# EAGLE design joule_shield (EAGLE 6.5.0)

## Sheet 1 of 12
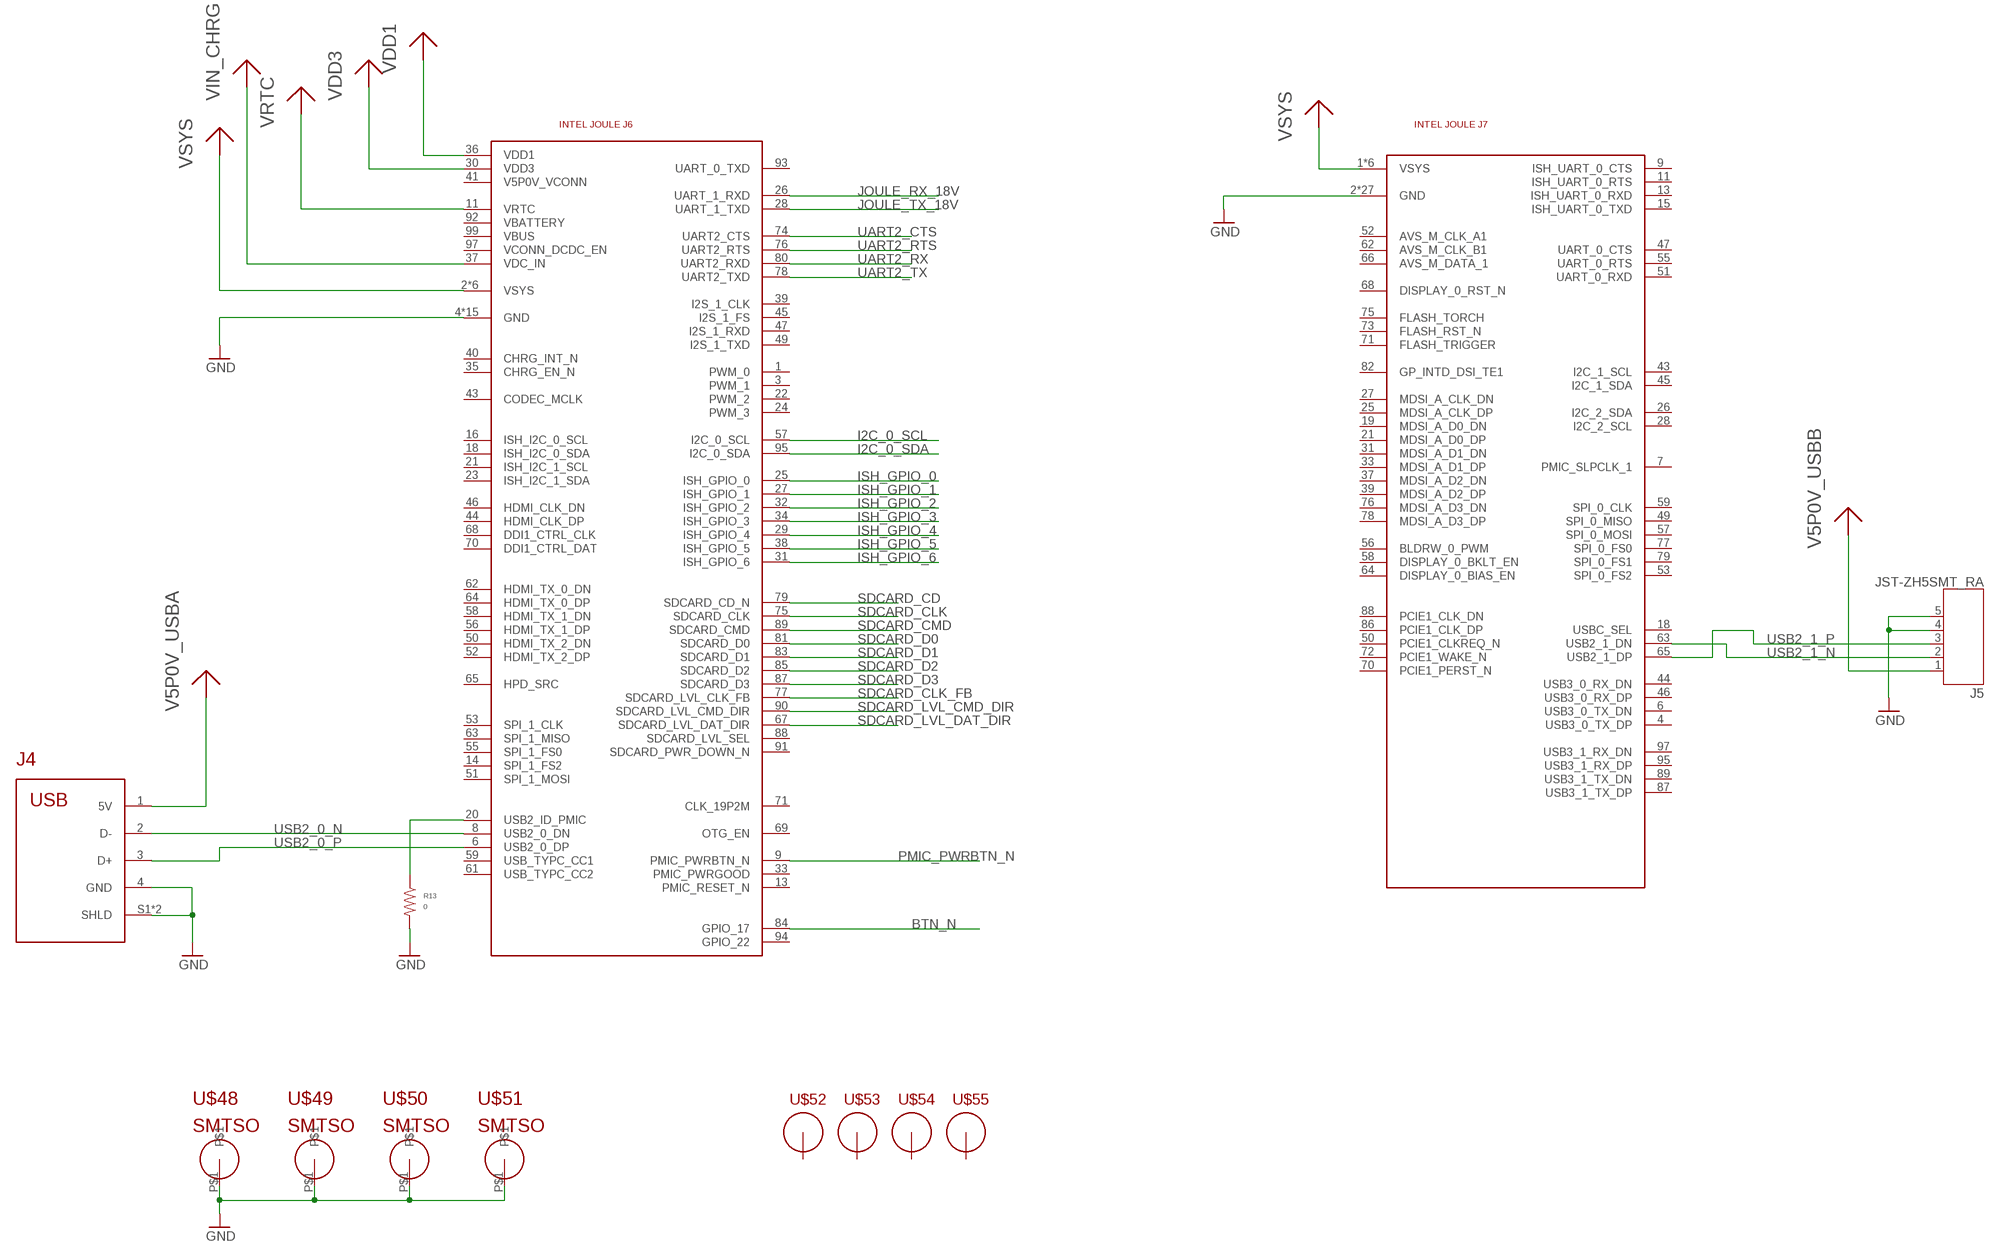
[diagram p0: schematic, sheet 1]

### Parts
J4  USB_AUSB_A_SMT_RA  [USB_RECPT_87583]
J5  JST-ZH5SMT_RA  [JST_ZH_SMT_RA_5]
J6  INTEL_JOULE_J6  [HIROSE-40C-100DS]
J7  INTEL_JOULE_J7  [HIROSE-40C-100DS]
R13  0  RESISTOR_0603  [R0603]
U$48  SMTSOSMTSO-M1.6  [SMTSO-M1.6]
U$49  SMTSOSMTSO-M1.6  [SMTSO-M1.6]
U$50  SMTSOSMTSO-M1.6  [SMTSO-M1.6]
U$51  SMTSOSMTSO-M1.6  [SMTSO-M1.6]
U$52  M2.5MOUNT  [M2.5MOUNT]
U$53  M2.5MOUNT  [M2.5MOUNT]
U$54  M2.5MOUNT  [M2.5MOUNT]
U$55  M2.5MOUNT  [M2.5MOUNT]

### Nets
BTN_N: J6.84(GPIO_17) ; also sheet 9
GND: J4.4(GND) J4.S1(SHLD) J4.S2(SHLD) J5.4 J5.5 J6.4(GND) J6.10(GND) J6.19(GND) J6.42(GND) J6.48(GND) J6.54(GND) J6.60(GND) J6.66(GND) J6.72(GND) J6.73(GND) J6.82(GND) J6.86(GND) J6.96(GND) J6.98(GND) J6.100(GND) J7.2(GND) J7.5(GND) J7.8(GND) J7.10(GND) J7.16(GND) J7.17(GND) J7.23(GND) J7.24(GND) J7.29(GND) J7.30(GND) J7.35(GND) J7.36(GND) J7.41(GND) J7.42(GND) J7.54(GND) J7.60(GND) J7.61(GND) J7.67(GND) J7.74(GND) J7.80(GND) J7.84(GND) J7.85(GND) J7.90(GND) J7.91(GND) J7.93(GND) J7.96(GND) J7.99(GND) R13.P$2 U$48.P$1 U$49.P$1 U$50.P$1 U$51.P$1 ; also sheet 2,3,4,5,6,7,8,9,10,11,12
I2C_0_SCL: J6.57(I2C_0_SCL) ; also sheet 2
I2C_0_SDA: J6.95(I2C_0_SDA) ; also sheet 2
ISH_GPIO_0: J6.25(ISH_GPIO_0) ; also sheet 12
ISH_GPIO_1: J6.27(ISH_GPIO_1) ; also sheet 12
ISH_GPIO_2: J6.32(ISH_GPIO_2) ; also sheet 12
ISH_GPIO_3: J6.34(ISH_GPIO_3) ; also sheet 6
ISH_GPIO_4: J6.29(ISH_GPIO_4) ; also sheet 6
ISH_GPIO_5: J6.38(ISH_GPIO_5) ; also sheet 6
ISH_GPIO_6: J6.31(ISH_GPIO_6) ; also sheet 6
JOULE_RX_18V: J6.26(UART_1_RXD) ; also sheet 7
JOULE_TX_18V: J6.28(UART_1_TXD) ; also sheet 7
N$10: J6.20(USB2_ID_PMIC) R13.P$1
PMIC_PWRBTN_N: J6.9(PMIC_PWRBTN_N) ; also sheet 2,9
SDCARD_CD: J6.79(SDCARD_CD_N) ; also sheet 10
SDCARD_CLK: J6.75(SDCARD_CLK) ; also sheet 10
SDCARD_CLK_FB: J6.77(SDCARD_LVL_CLK_FB) ; also sheet 10
SDCARD_CMD: J6.89(SDCARD_CMD) ; also sheet 10
SDCARD_D0: J6.81(SDCARD_D0) ; also sheet 10
SDCARD_D1: J6.83(SDCARD_D1) ; also sheet 10
SDCARD_D2: J6.85(SDCARD_D2) ; also sheet 10
SDCARD_D3: J6.87(SDCARD_D3) ; also sheet 10
SDCARD_LVL_CMD_DIR: J6.90(SDCARD_LVL_CMD_DIR) ; also sheet 10
SDCARD_LVL_DAT_DIR: J6.67(SDCARD_LVL_DAT_DIR) ; also sheet 10
UART2_CTS: J6.74(UART2_CTS) ; also sheet 11
UART2_RTS: J6.76(UART2_RTS) ; also sheet 11
UART2_RX: J6.80(UART2_RXD) ; also sheet 11
UART2_TX: J6.78(UART2_TXD) ; also sheet 9,11
USB2_0_N [USB]: J4.2(D-) J6.8(USB2_0_DN)
USB2_0_P [USB]: J4.3(D+) J6.6(USB2_0_DP)
USB2_1_N [USB]: J5.2 J7.63(USB2_1_DN)
USB2_1_P [USB]: J5.3 J7.65(USB2_1_DP)
V5P0V_USBA: J4.1(5V) ; also sheet 6
V5P0V_USBB: J5.1 ; also sheet 6
VDD1: J6.36(VDD1) ; also sheet 5,6,9
VDD3: J6.30(VDD3) ; also sheet 3,4
VIN_CHRG: J6.37(VDC_IN) ; also sheet 2,8
VRTC: J6.11(VRTC) ; also sheet 9
VSYS: J6.2(VSYS) J6.5(VSYS) J6.7(VSYS) J6.12(VSYS) J6.15(VSYS) J6.17(VSYS) J7.1(VSYS) J7.3(VSYS) J7.20(VSYS) J7.22(VSYS) J7.32(VSYS) J7.34(VSYS) ; also sheet 2,3,12
Unconnected: J6.1(PWM_0) J6.3(PWM_1) J6.13(PMIC_RESET_N) J6.14(SPI_1_FS2) J6.16(ISH_I2C_0_SCL) J6.18(ISH_I2C_0_SDA) J6.21(ISH_I2C_1_SCL) J6.22(PWM_2) J6.23(ISH_I2C_1_SDA) J6.24(PWM_3) J6.33(PMIC_PWRGOOD) J6.35(CHRG_EN_N) J6.39(I2S_1_CLK) J6.40(CHRG_INT_N) J6.41(V5P0V_VCONN) J6.43(CODEC_MCLK) J6.44(HDMI_CLK_DP) J6.45(I2S_1_FS) J6.46(HDMI_CLK_DN) J6.47(I2S_1_RXD) J6.49(I2S_1_TXD) J6.50(HDMI_TX_2_DN) J6.51(SPI_1_MOSI) J6.52(HDMI_TX_2_DP) J6.53(SPI_1_CLK) J6.55(SPI_1_FS0) J6.56(HDMI_TX_1_DP) J6.58(HDMI_TX_1_DN) J6.59(USB_TYPC_CC1) J6.61(USB_TYPC_CC2) J6.62(HDMI_TX_0_DN) J6.63(SPI_1_MISO) J6.64(HDMI_TX_0_DP) J6.65(HPD_SRC) J6.68(DDI1_CTRL_CLK) J6.69(OTG_EN) J6.70(DDI1_CTRL_DAT) J6.71(CLK_19P2M) J6.88(SDCARD_LVL_SEL) J6.91(SDCARD_PWR_DOWN_N) J6.92(VBATTERY) J6.93(UART_0_TXD) J6.94(GPIO_22) J6.97(VCONN_DCDC_EN) J6.99(VBUS) J7.4(USB3_0_TX_DP) J7.6(USB3_0_TX_DN) J7.7(PMIC_SLPCLK_1) J7.9(ISH_UART_0_CTS) J7.11(ISH_UART_0_RTS) J7.13(ISH_UART_0_RXD) J7.15(ISH_UART_0_TXD) J7.18(USBC_SEL) J7.19(MDSI_A_D0_DN) J7.21(MDSI_A_D0_DP) J7.25(MDSI_A_CLK_DP) J7.26(I2C_2_SDA) J7.27(MDSI_A_CLK_DN) J7.28(I2C_2_SCL) J7.31(MDSI_A_D1_DN) J7.33(MDSI_A_D1_DP) J7.37(MDSI_A_D2_DN) J7.39(MDSI_A_D2_DP) J7.43(I2C_1_SCL) J7.44(USB3_0_RX_DN) J7.45(I2C_1_SDA) J7.46(USB3_0_RX_DP) J7.47(UART_0_CTS) J7.49(SPI_0_MISO) J7.50(PCIE1_CLKREQ_N) J7.51(UART_0_RXD) J7.52(AVS_M_CLK_A1) J7.53(SPI_0_FS2) J7.55(UART_0_RTS) J7.56(BLDRW_0_PWM) J7.57(SPI_0_MOSI) J7.58(DISPLAY_0_BKLT_EN) J7.59(SPI_0_CLK) J7.62(AVS_M_CLK_B1) J7.64(DISPLAY_0_BIAS_EN) J7.66(AVS_M_DATA_1) J7.68(DISPLAY_0_RST_N) J7.70(PCIE1_PERST_N) J7.71(FLASH_TRIGGER) J7.72(PCIE1_WAKE_N) J7.73(FLASH_RST_N) J7.75(FLASH_TORCH) J7.76(MDSI_A_D3_DN) J7.77(SPI_0_FS0) J7.78(MDSI_A_D3_DP) J7.79(SPI_0_FS1) J7.82(GP_INTD_DSI_TE1) J7.86(PCIE1_CLK_DP) J7.87(USB3_1_TX_DP) J7.88(PCIE1_CLK_DN) J7.89(USB3_1_TX_DN) J7.95(USB3_1_RX_DP) J7.97(USB3_1_RX_DN) U$52.P$1 U$53.P$1 U$54.P$1 U$55.P$1

## Sheet 2 of 12
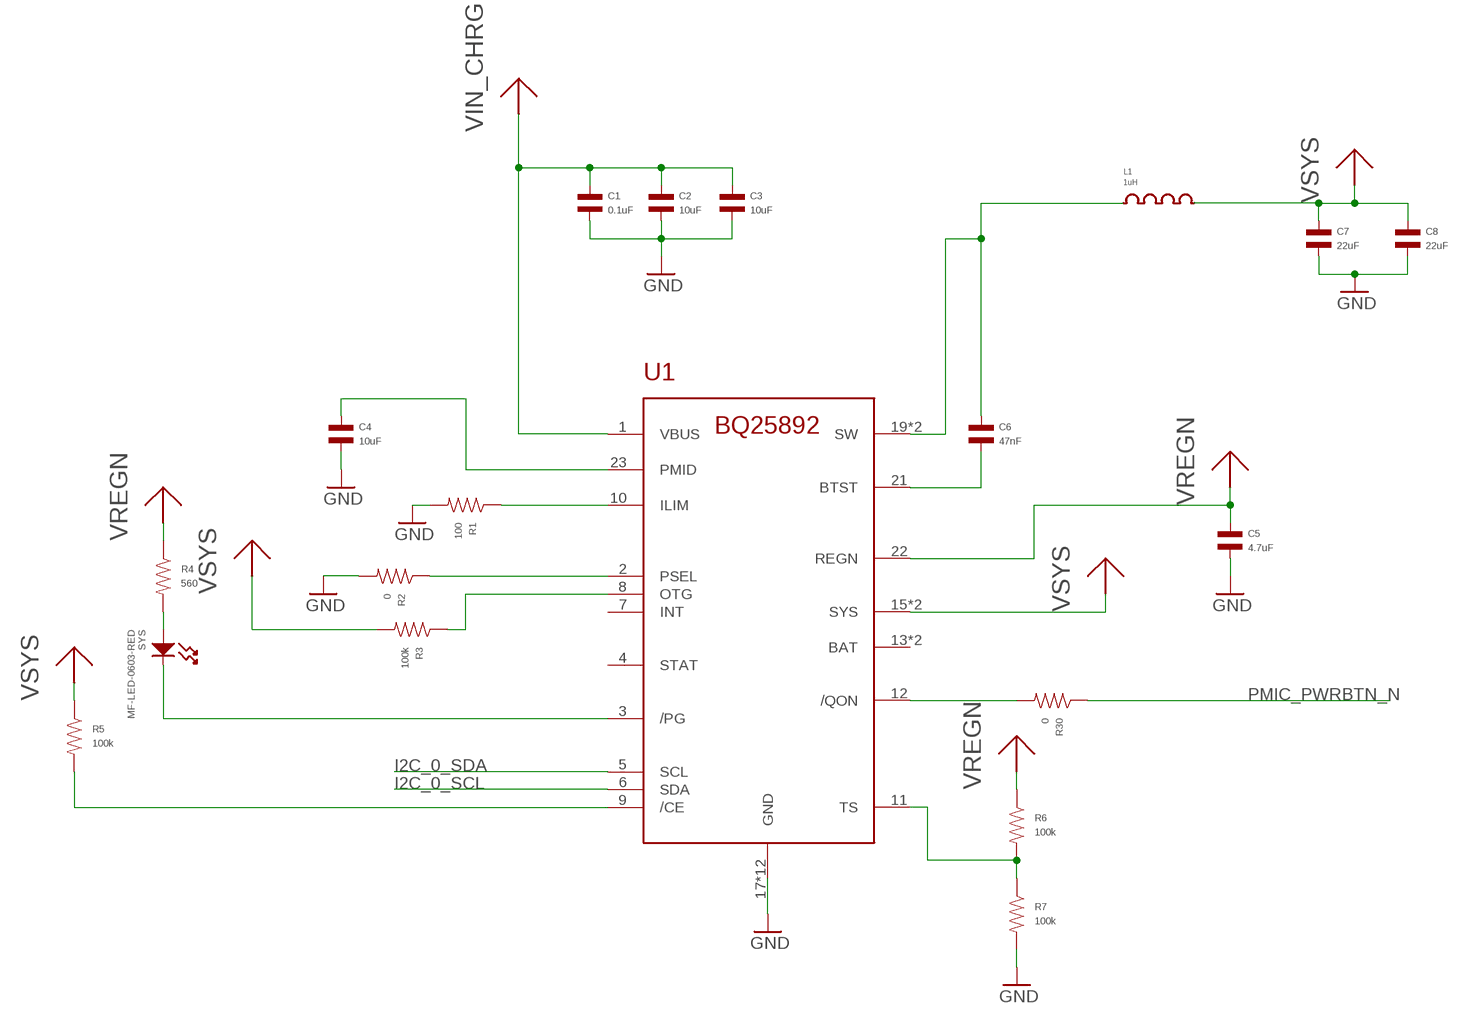
[diagram p1: schematic, sheet 2]

### Parts
C1  0.1uF  CAPACITOR_NP_0603  [C0603]
C2  10uF  CAPACITOR_NP_0603  [C0603]
C3  10uF  CAPACITOR_NP_0603  [C0603]
C4  10uF  CAPACITOR_NP_0603  [C0603]
C5  4.7uF  CAPACITOR_NP_0603  [C0603]
C6  47nF  CAPACITOR_NP_0603  [C0603]
C7  22uF  CAPACITOR_NP_0603  [C0603]
C8  22uF  CAPACITOR_NP_0603  [C0603]
L1  1uH  INDUCTORSPM4012  [SPM4012]
R1  100  RESISTOR_0603  [R0603]
R2  0  RESISTOR_0603  [R0603]
R3  100k  RESISTOR_0603  [R0603]
R4  560  RESISTOR_0603  [R0603]
R5  100k  RESISTOR_0603  [R0603]
R6  100k  RESISTOR_0603  [R0603]
R7  100k  RESISTOR_0603  [R0603]
R30  0  RESISTOR_0603  [R0603]
SYS  MF-LED-0603-RED  LED_SINGLE-0603-RED  [LED0603]
U1  BQ25892PWQFN-24  [PWQFN-24]

### Nets
GND: C1.P$2 C2.P$2 C3.P$2 C4.P$2 C5.P$2 C7.P$2 C8.P$2 R1.P$2 R2.P$2 R7.P$2 U1.17(GND) U1.18(GND) U1.G0(GND) U1.G1(GND) U1.G2(GND) U1.G3(GND) U1.G4(GND) U1.G5(GND) U1.G6(GND) U1.G7(GND) U1.G8(GND) U1.G9(GND) ; also sheet 1,3,4,5,6,7,8,9,10,11,12
I2C_0_SCL: U1.6(SDA) ; also sheet 1
I2C_0_SDA: U1.5(SCL) ; also sheet 1
N$1: R4.P$2 SYS.ANODE
N$2: C4.P$1 U1.23(PMID)
N$3: R1.P$1 U1.10(ILIM)
N$4: R2.P$1 U1.2(PSEL)
N$5: R3.P$1 U1.8(OTG)
N$6: SYS.CATHODE U1.3(/PG)
N$8: R6.P$2 R7.P$1 U1.11(TS)
N$9: R5.P$2 U1.9(/CE)
N$11: C6.P$2 U1.21(BTST)
N$12: C6.P$1 L1.1 U1.19(SW) U1.20(SW)
N$51: R30.P$2 U1.12(/QON)
PMIC_PWRBTN_N: R30.P$1 ; also sheet 1,9
VIN_CHRG: C1.P$1 C2.P$1 C3.P$1 U1.1(VBUS) ; also sheet 1,8
VREGN: C5.P$1 R4.P$1 R6.P$1 U1.22(REGN)
VSYS: C7.P$1 C8.P$1 L1.2 R3.P$2 R5.P$1 U1.15(SYS) U1.16(SYS) ; also sheet 1,3,12
Unconnected: U1.4(STAT) U1.7(INT) U1.13(BAT) U1.14(BAT)

## Sheet 3 of 12
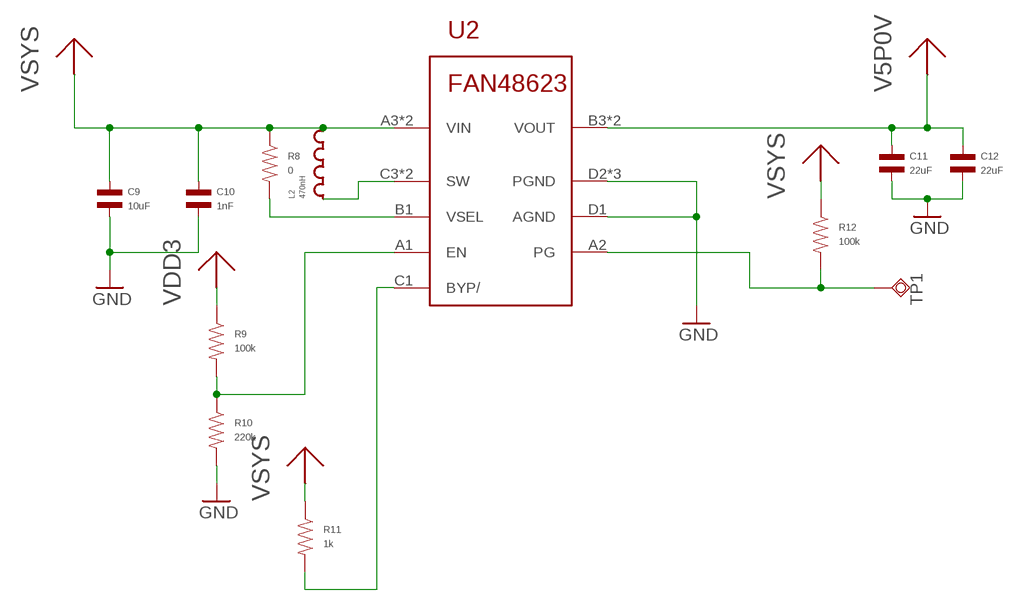
[diagram p2: schematic, sheet 3]

### Parts
C9  10uF  CAPACITOR_NP_0603  [C0603]
C10  1nF  CAPACITOR_NP_0603  [C0603]
C11  22uF  CAPACITOR_NP_0603  [C0603]
C12  22uF  CAPACITOR_NP_0603  [C0603]
L2  470nH  INDUCTORDFE252010P  [DFE252010P]
R8  0  RESISTOR_0603  [R0603]
R9  100k  RESISTOR_0603  [R0603]
R10  220k  RESISTOR_0603  [R0603]
R11  1k  RESISTOR_0603  [R0603]
R12  100k  RESISTOR_0603  [R0603]
TP1  TPSQB1,27  [B1,27]
U2  FAN8623WLCSP16  [WLCSP16]

### Nets
GND: C9.P$2 C10.P$2 C11.P$2 C12.P$2 R10.P$2 U2.D1(AGND) U2.D2(PGND) U2.D3(PGND) U2.D4(PGND) ; also sheet 1,2,4,5,6,7,8,9,10,11,12
N$7: R8.P$2 U2.B1(VSEL)
N$13: L2.1 U2.C3(SW) U2.C4(SW)
N$14: R9.P$2 R10.P$1 U2.A1(EN)
N$15: R11.P$2 U2.C1(BYP/)
N$18: R12.P$2 TP1.TP U2.A2(PG)
V5P0V: C11.P$1 C12.P$1 U2.B3(VOUT) U2.B4(VOUT) ; also sheet 6,7,9,11
VDD3: R9.P$1 ; also sheet 1,4
VSYS: C9.P$1 C10.P$1 L2.2 R8.P$1 R11.P$1 R12.P$1 U2.A3(VIN) U2.A4(VIN) ; also sheet 1,2,12

## Sheet 4 of 12
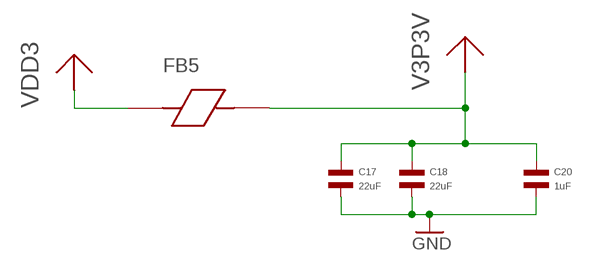
[diagram p3: schematic, sheet 4]

### Parts
C17  22uF  CAPACITOR_NP_0603  [C0603]
C18  22uF  CAPACITOR_NP_0603  [C0603]
C20  1uF  CAPACITOR_NP_0603  [C0603]
FB5  FERRITE_BEAD  [R0603]

### Nets
GND: C17.P$2 C18.P$2 C20.P$2 ; also sheet 1,2,3,5,6,7,8,9,10,11,12
V3P3V: C17.P$1 C18.P$1 C20.P$1 FB5.P$2 ; also sheet 9,10
VDD3: FB5.P$1 ; also sheet 1,3

## Sheet 5 of 12
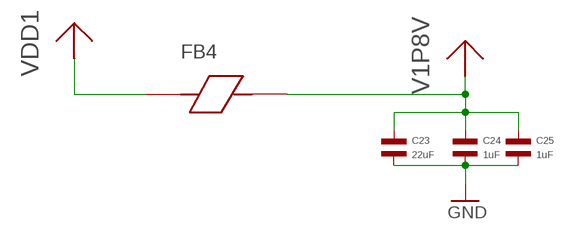
[diagram p4: schematic, sheet 5]

### Parts
C23  22uF  CAPACITOR_NP_0603  [C0603]
C24  1uF  CAPACITOR_NP_0603  [C0603]
C25  1uF  CAPACITOR_NP_0603  [C0603]
FB4  FERRITE_BEAD  [R0603]

### Nets
GND: C23.P$2 C24.P$2 C25.P$2 ; also sheet 1,2,3,4,6,7,8,9,10,11,12
V1P8V: C23.P$1 C24.P$1 C25.P$1 FB4.P$2 ; also sheet 7,10,11
VDD1: FB4.P$1 ; also sheet 1,6,9

## Sheet 6 of 12
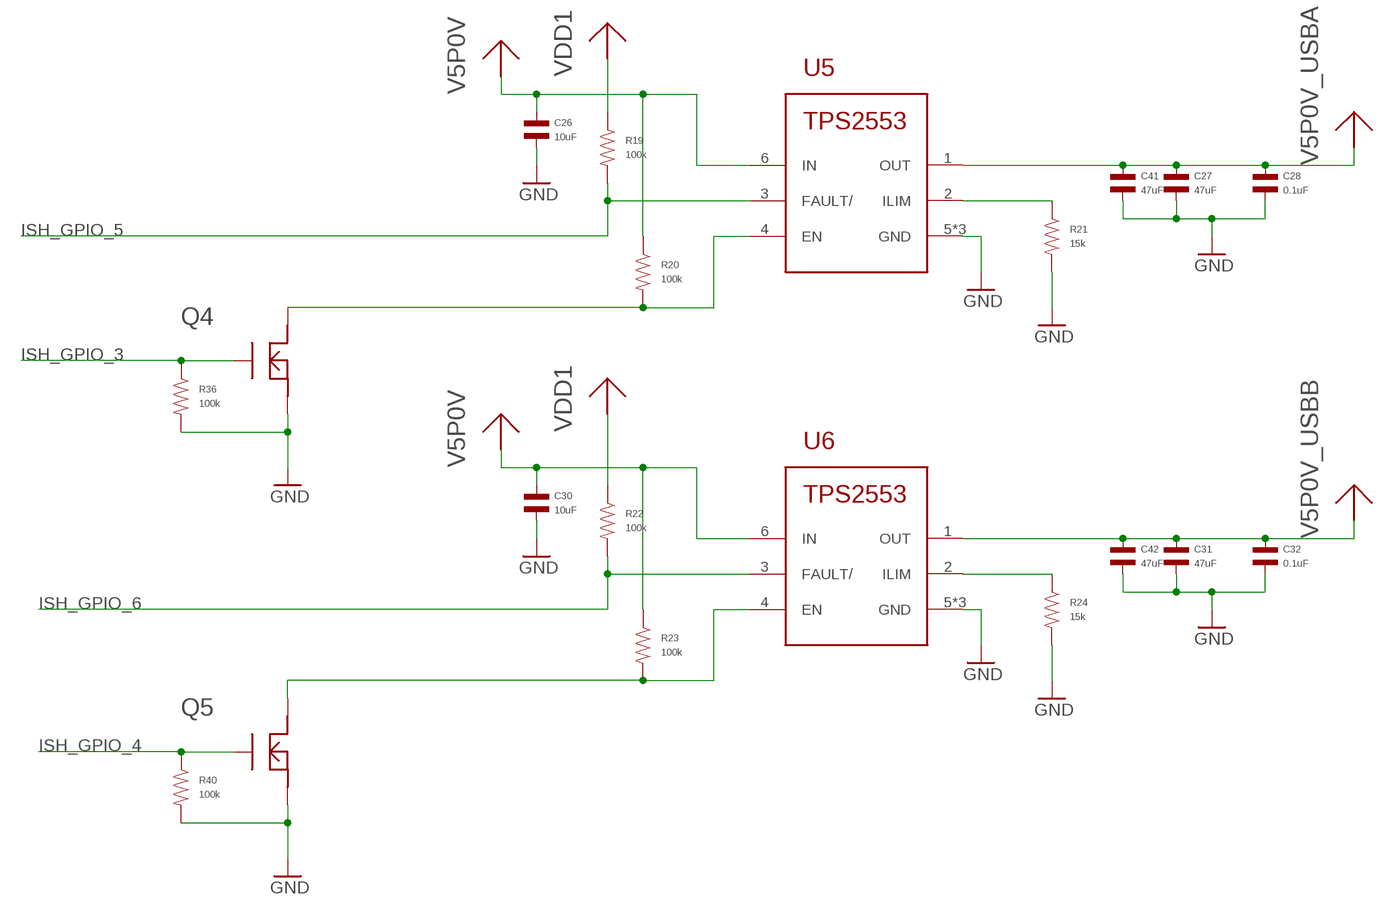
[diagram p5: schematic, sheet 6]

### Parts
C26  10uF  CAPACITOR_NP_0603  [C0603]
C27  47uF  CAPACITOR_NP_0805  [C0805]
C28  0.1uF  CAPACITOR_NP_0603  [C0603]
C30  10uF  CAPACITOR_NP_0603  [C0603]
C31  47uF  CAPACITOR_NP_0805  [C0805]
C32  0.1uF  CAPACITOR_NP_0603  [C0603]
C41  47uF  CAPACITOR_NP_0805  [C0805]
C42  47uF  CAPACITOR_NP_0805  [C0805]
Q4  NFETEMT3F  [EMT3F]
Q5  NFETEMT3F  [EMT3F]
R19  100k  RESISTOR_0603  [R0603]
R20  100k  RESISTOR_0603  [R0603]
R21  15k  RESISTOR_0603  [R0603]
R22  100k  RESISTOR_0603  [R0603]
R23  100k  RESISTOR_0603  [R0603]
R24  15k  RESISTOR_0603  [R0603]
R36  100k  RESISTOR_0603  [R0603]
R40  100k  RESISTOR_0603  [R0603]
U5  TPS2553PWSON-6  [PWSON-6]
U6  TPS2553PWSON-6  [PWSON-6]

### Nets
GND: C26.P$2 C27.P$2 C28.P$2 C30.P$2 C31.P$2 C32.P$2 C41.P$2 C42.P$2 Q4.2(S) Q5.2(S) R21.P$2 R24.P$2 R36.P$2 R40.P$2 U5.5(GND) U5.G0(GND) U5.G1(GND) U6.5(GND) U6.G0(GND) U6.G1(GND) ; also sheet 1,2,3,4,5,7,8,9,10,11,12
ISH_GPIO_3: Q4.1(G) R36.P$1 ; also sheet 1
ISH_GPIO_4: Q5.1(G) R40.P$1 ; also sheet 1
ISH_GPIO_5: R19.P$2 U5.3(FAULT/) ; also sheet 1
ISH_GPIO_6: R22.P$2 U6.3(FAULT/) ; also sheet 1
N$24: Q4.3(D) R20.P$2 U5.4(EN)
N$29: R21.P$1 U5.2(ILIM)
N$33: Q5.3(D) R23.P$2 U6.4(EN)
N$34: R24.P$1 U6.2(ILIM)
V5P0V: C26.P$1 C30.P$1 R20.P$1 R23.P$1 U5.6(IN) U6.6(IN) ; also sheet 3,7,9,11
V5P0V_USBA: C27.P$1 C28.P$1 C41.P$1 U5.1(OUT) ; also sheet 1
V5P0V_USBB: C31.P$1 C32.P$1 C42.P$1 U6.1(OUT) ; also sheet 1
VDD1: R19.P$1 R22.P$1 ; also sheet 1,5,9

## Sheet 7 of 12
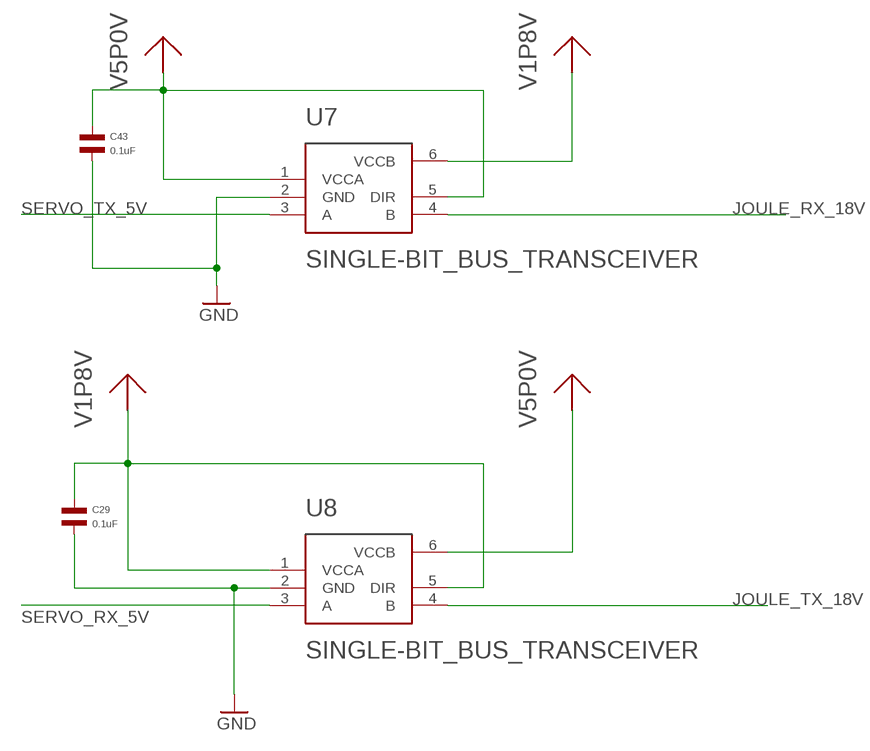
[diagram p6: schematic, sheet 7]

### Parts
C29  0.1uF  CAPACITOR_NP_0603  [C0603]
C43  0.1uF  CAPACITOR_NP_0603  [C0603]
U7  SINGLE-BIT_BUS_TRANSCEIVER  [SOT23-6]
U8  SINGLE-BIT_BUS_TRANSCEIVER  [SOT23-6]

### Nets
GND: C29.P$2 C43.P$2 U7.2(GND) U8.2(GND) ; also sheet 1,2,3,4,5,6,8,9,10,11,12
JOULE_RX_18V: U7.4(B) ; also sheet 1
JOULE_TX_18V: U8.4(B) ; also sheet 1
SERVO_RX_5V: U8.3(A) ; also sheet 8
SERVO_TX_5V: U7.3(A) ; also sheet 8
V1P8V: C29.P$1 U7.6(VCCB) U8.1(VCCA) U8.5(DIR) ; also sheet 5,10,11
V5P0V: C43.P$1 U7.1(VCCA) U7.5(DIR) U8.6(VCCB) ; also sheet 3,6,9,11

## Sheet 8 of 12
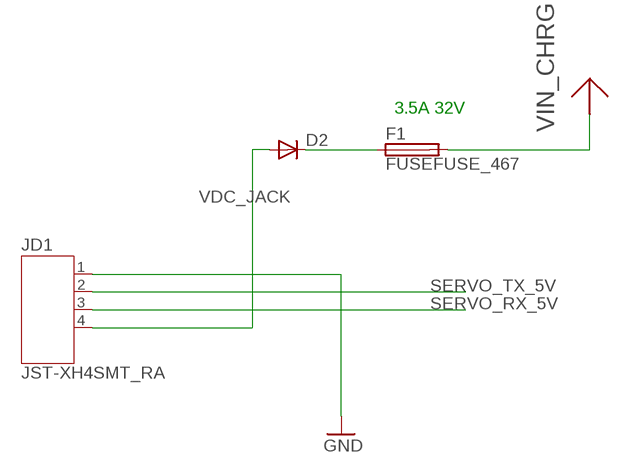
[diagram p7: schematic, sheet 8]

### Parts
D2  DIODE-B520C  [B520C]
F1  FUSEFUSE_467  [FUSE_467]
JD1  JST-XH4SMT_RA  [JST_XH_SMT_RA_4]

### Nets
GND: JD1.1 ; also sheet 1,2,3,4,5,6,7,9,10,11,12
N$31: D2.1(C) F1.1
SERVO_RX_5V: JD1.3 ; also sheet 7
SERVO_TX_5V: JD1.2 ; also sheet 7
VDC_JACK: D2.2(A) JD1.4
VIN_CHRG: F1.2 ; also sheet 1,2

### Notes on the sheet
- 3.5A 32V

## Sheet 9 of 12
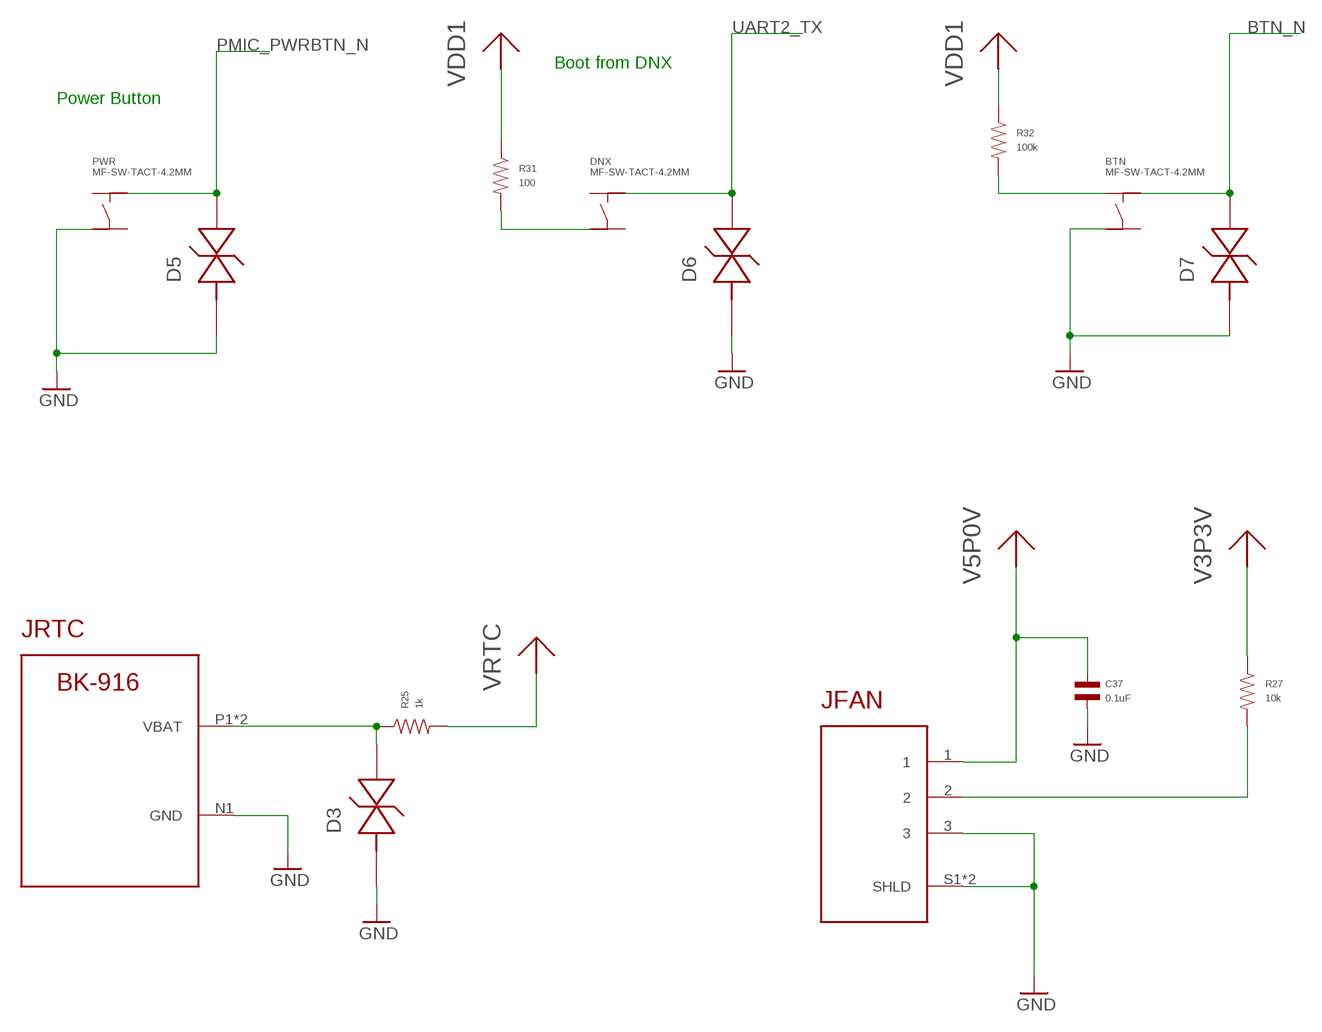
[diagram p8: schematic, sheet 9]

### Parts
BTN  MF-SW-TACT-4.2MM  TACT_4.2MM  [TACT4.2MM]
C37  0.1uF  CAPACITOR_NP_0603  [C0603]
D3  ESD_DIODEM1005  [M1005]
D5  ESD_DIODEM1005  [M1005]
D6  ESD_DIODEM1005  [M1005]
D7  ESD_DIODEM1005  [M1005]
DNX  MF-SW-TACT-4.2MM  TACT_4.2MM  [TACT4.2MM]
JFAN  AMP_MINI_FAN  [AMP_MINI_292228]
JRTC  BC-2009  [BC-2009]
PWR  MF-SW-TACT-4.2MM  TACT_4.2MM  [TACT4.2MM]
R25  1k  RESISTOR_0603  [R0603]
R27  10k  RESISTOR_0603  [R0603]
R31  100  RESISTOR_0603  [R0603]
R32  100k  RESISTOR_0603  [R0603]

### Nets
BTN_N: BTN.P$2 D7.P$2 ; also sheet 1
GND: BTN.P$3 C37.P$2 D3.P$1 D5.P$1 D6.P$1 D7.P$1 JFAN.3 JFAN.S1(SHLD) JFAN.S2(SHLD) JRTC.N1(GND) PWR.P$3 ; also sheet 1,2,3,4,5,6,7,8,10,11,12
N$30: D3.P$2 JRTC.P1(VBAT) JRTC.P2(VBAT) R25.P$1
N$36: JFAN.2 R27.P$2
N$52: DNX.P$3 R31.P$2
N$54: BTN.P$1 R32.P$2
PMIC_PWRBTN_N: D5.P$2 PWR.P$2 ; also sheet 1,2
UART2_TX: D6.P$2 DNX.P$2 ; also sheet 1,11
V3P3V: R27.P$1 ; also sheet 4,10
V5P0V: C37.P$1 JFAN.1 ; also sheet 3,6,7,11
VDD1: R31.P$1 R32.P$1 ; also sheet 1,5,6
VRTC: R25.P$2 ; also sheet 1
Unconnected: BTN.P$4 DNX.P$1 DNX.P$4 PWR.P$1 PWR.P$4

### Notes on the sheet
- Boot from DNX
- Power Button

## Sheet 10 of 12
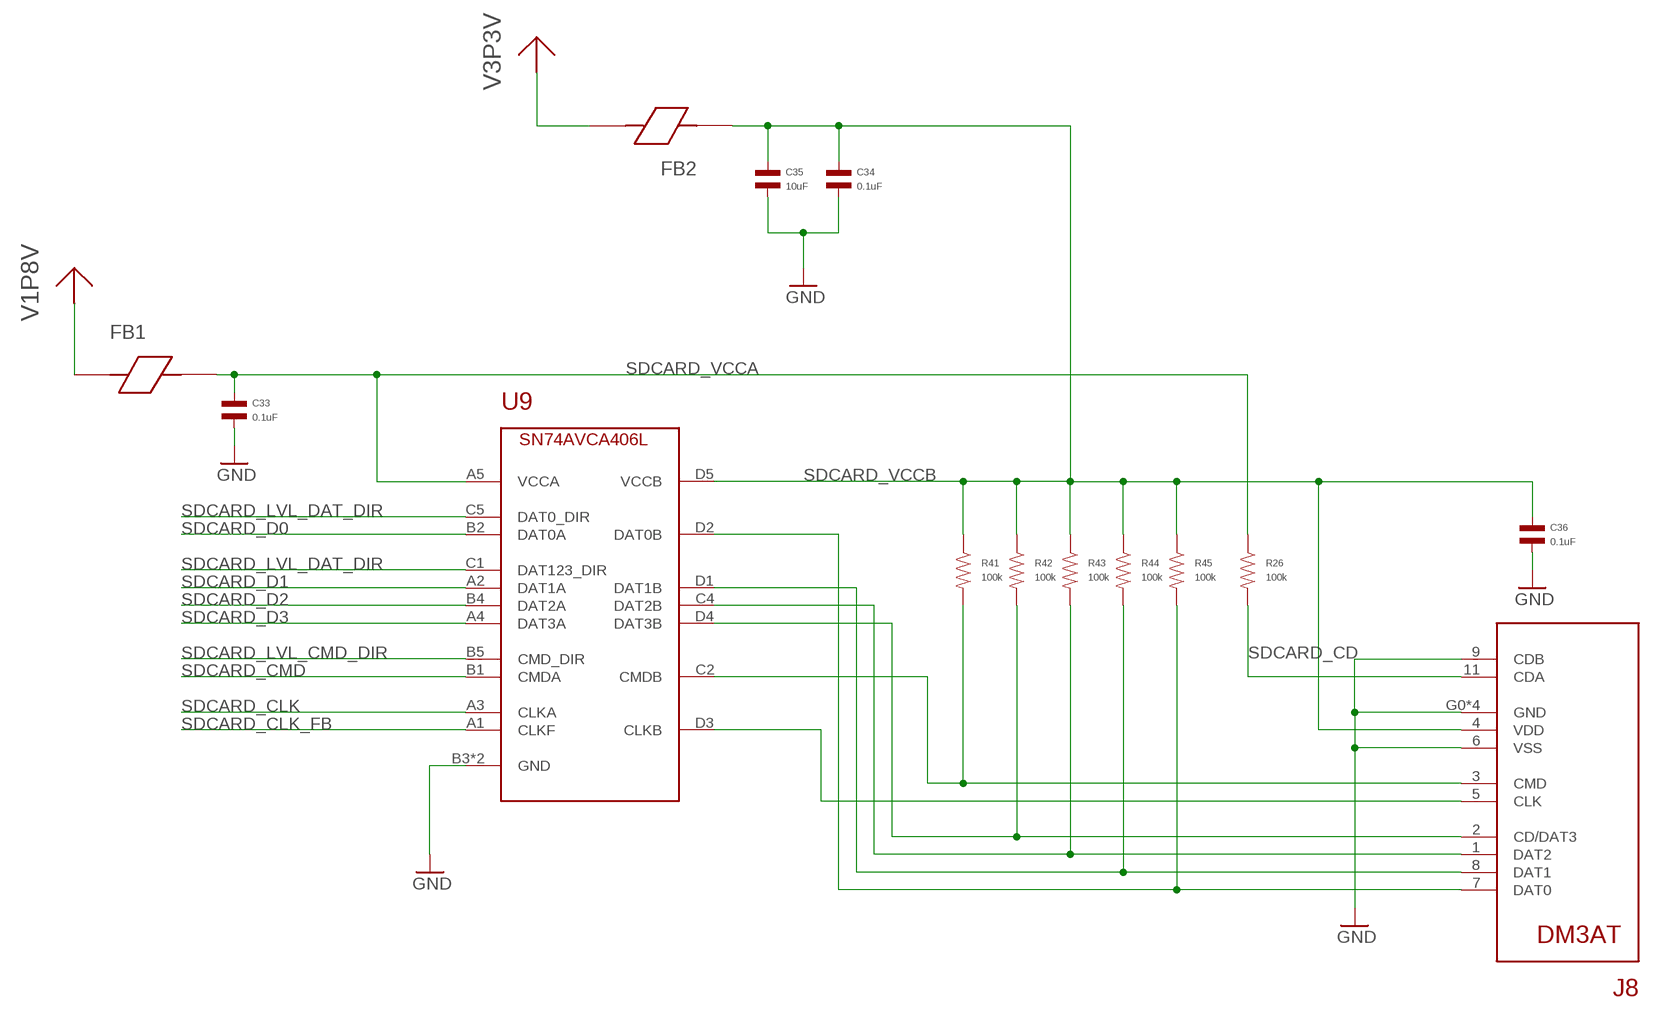
[diagram p9: schematic, sheet 10]

### Parts
C33  0.1uF  CAPACITOR_NP_0603  [C0603]
C34  0.1uF  CAPACITOR_NP_0603  [C0603]
C35  10uF  CAPACITOR_NP_0603  [C0603]
C36  0.1uF  CAPACITOR_NP_0603  [C0603]
FB1  FERRITE_BEAD  [R0603]
FB2  FERRITE_BEAD  [R0603]
J8  DM3ATDM3AT  [DM3AT]
R26  100k  RESISTOR_0603  [R0603]
R41  100k  RESISTOR_0603  [R0603]
R42  100k  RESISTOR_0603  [R0603]
R43  100k  RESISTOR_0603  [R0603]
R44  100k  RESISTOR_0603  [R0603]
R45  100k  RESISTOR_0603  [R0603]
U9  SN74AVCA406L  [S-PBGA-N20]

### Nets
GND: C33.P$2 C34.P$2 C35.P$2 C36.P$2 J8.6(VSS) J8.9(CDB) J8.G0(GND) J8.G1(GND) J8.G2(GND) J8.G3(GND) U9.B3(GND) U9.C3(GND) ; also sheet 1,2,3,4,5,6,7,8,9,11,12
N$41: J8.8(DAT1) R44.P$2 U9.D1(DAT1B)
N$42: J8.1(DAT2) R43.P$2 U9.C4(DAT2B)
N$43: J8.2(CD/DAT3) R42.P$2 U9.D4(DAT3B)
N$44: J8.3(CMD) R41.P$2 U9.C2(CMDB)
N$45: J8.5(CLK) U9.D3(CLKB)
N$69: J8.7(DAT0) R45.P$2 U9.D2(DAT0B)
SDCARD_CD: J8.11(CDA) R26.P$2 ; also sheet 1
SDCARD_CLK: U9.A3(CLKA) ; also sheet 1
SDCARD_CLK_FB: U9.A1(CLKF) ; also sheet 1
SDCARD_CMD: U9.B1(CMDA) ; also sheet 1
SDCARD_D0: U9.B2(DAT0A) ; also sheet 1
SDCARD_D1: U9.A2(DAT1A) ; also sheet 1
SDCARD_D2: U9.B4(DAT2A) ; also sheet 1
SDCARD_D3: U9.A4(DAT3A) ; also sheet 1
SDCARD_LVL_CMD_DIR: U9.B5(CMD_DIR) ; also sheet 1
SDCARD_LVL_DAT_DIR: U9.C1(DAT123_DIR) U9.C5(DAT0_DIR) ; also sheet 1
SDCARD_VCCA: C33.P$1 FB1.P$2 R26.P$1 U9.A5(VCCA)
SDCARD_VCCB: C34.P$1 C35.P$1 C36.P$1 FB2.P$1 J8.4(VDD) R41.P$1 R42.P$1 R43.P$1 R44.P$1 R45.P$1 U9.D5(VCCB)
V1P8V: FB1.P$1 ; also sheet 5,7,11
V3P3V: FB2.P$2 ; also sheet 4,9

## Sheet 11 of 12
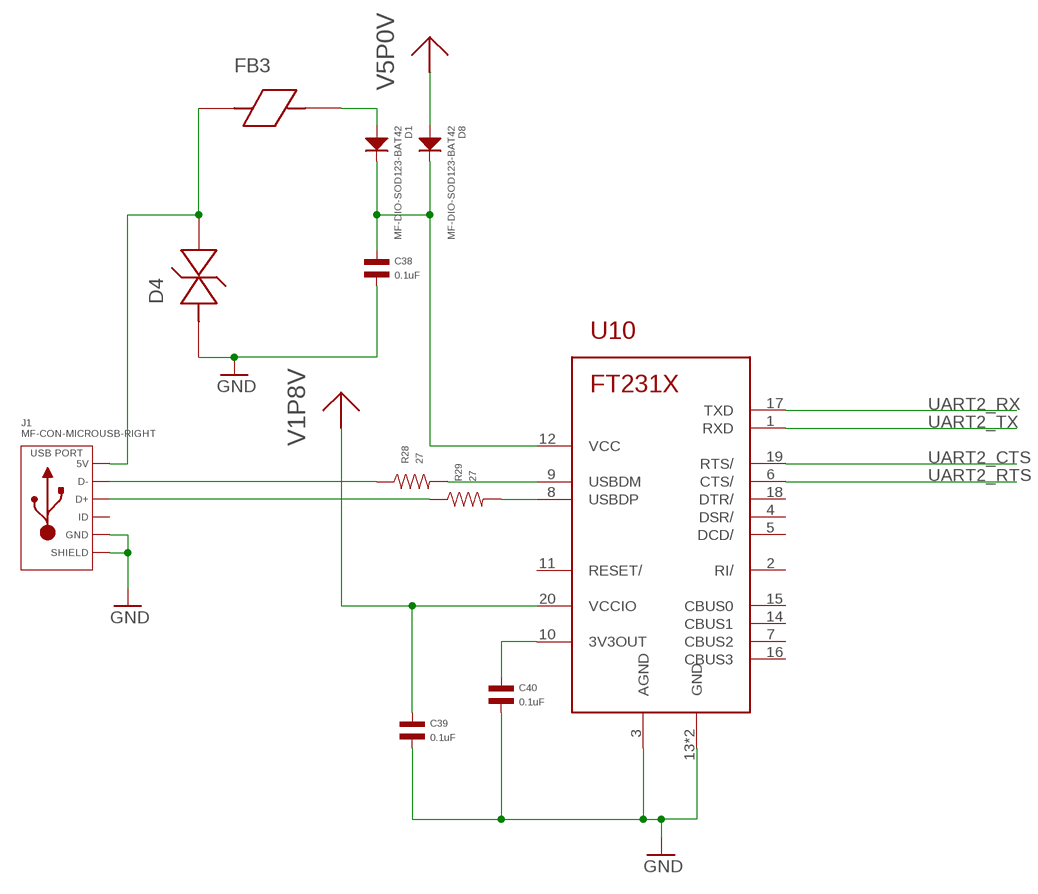
[diagram p10: schematic, sheet 11]

### Parts
C38  0.1uF  CAPACITOR_NP_0603  [C0603]
C39  0.1uF  CAPACITOR_NP_0603  [C0603]
C40  0.1uF  CAPACITOR_NP_0603  [C0603]
D1  MF-DIO-SOD123-BAT42  DIODES_BAT42_SOD-123  [SOD-123]
D4  ESD_DIODEM1005  [M1005]
D8  MF-DIO-SOD123-BAT42  DIODES_BAT42_SOD-123  [SOD-123]
FB3  FERRITE_BEAD  [R0603]
J1  MF-CON-MICROUSB-RIGHT  USB_MICRO_RIGHT  [MICROUSB-RIGHT]
R28  27  RESISTOR_0603  [R0603]
R29  27  RESISTOR_0603  [R0603]
U10  FT231XQFN-20  [QFN-20]

### Nets
GND: C38.P$2 C39.P$2 C40.P$2 D4.P$1 J1.5(GND) J1.S1(SLD) J1.S2(SLD) J1.S3(SLD) J1.S4(SLD) J1.S5(SLD) J1.S6(SLD) U10.3(AGND) U10.13(GND) U10.G0(GND) ; also sheet 1,2,3,4,5,6,7,8,9,10,12
N$16: D1.ANODE FB3.P$2
N$39: R28.P$2 U10.9(USBDM)
N$46: D4.P$2 FB3.P$1 J1.1(5V)
N$47: R29.P$2 U10.8(USBDP)
N$48 [USB]: J1.3(D+) R29.P$1
N$49: C38.P$1 D1.CATHODE D8.CATHODE U10.12(VCC)
N$50 [USB]: J1.2(D-) R28.P$1
N$53: C40.P$1 U10.10(3V3OUT)
UART2_CTS: U10.19(RTS/) ; also sheet 1
UART2_RTS: U10.6(CTS/) ; also sheet 1
UART2_RX: U10.17(TXD) ; also sheet 1
UART2_TX: U10.1(RXD) ; also sheet 1,9
V1P8V: C39.P$1 U10.20(VCCIO) ; also sheet 5,7,10
V5P0V: D8.ANODE ; also sheet 3,6,7,9
Unconnected: J1.4(ID) U10.2(RI/) U10.4(DSR/) U10.5(DCD/) U10.7(CBUS2) U10.11(RESET/) U10.14(CBUS1) U10.15(CBUS0) U10.16(CBUS3) U10.18(DTR/)

## Sheet 12 of 12
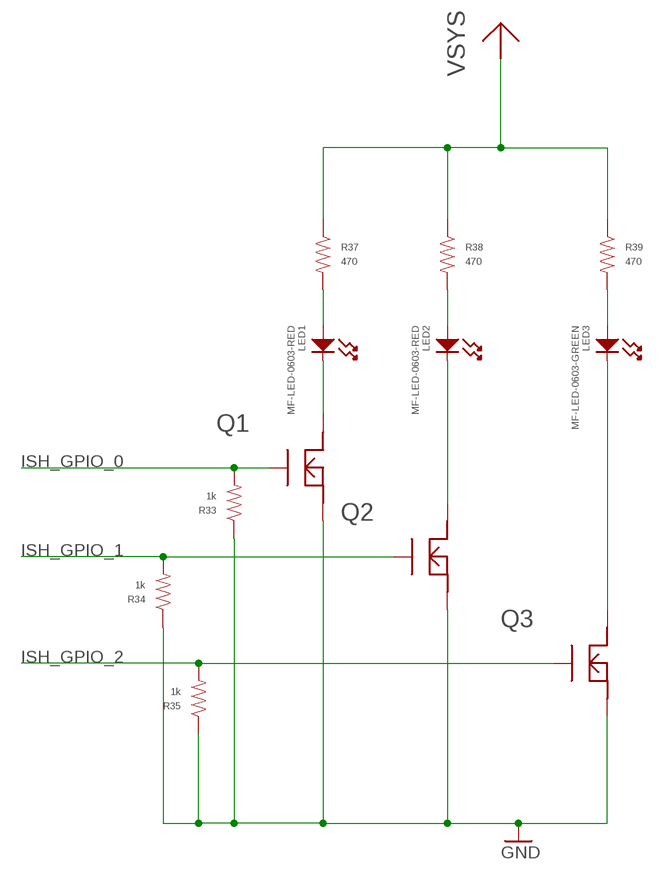
[diagram p11: schematic, sheet 12]

### Parts
LED1  MF-LED-0603-RED  LED_SINGLE-0603-RED  [LED0603]
LED2  MF-LED-0603-RED  LED_SINGLE-0603-RED  [LED0603]
LED3  MF-LED-0603-GREEN  LED_SINGLE-0603-GREEN  [LED0603]
Q1  NFETEMT3F  [EMT3F]
Q2  NFETEMT3F  [EMT3F]
Q3  NFETEMT3F  [EMT3F]
R33  1k  RESISTOR_0603  [R0603]
R34  1k  RESISTOR_0603  [R0603]
R35  1k  RESISTOR_0603  [R0603]
R37  470  RESISTOR_0603  [R0603]
R38  470  RESISTOR_0603  [R0603]
R39  470  RESISTOR_0603  [R0603]

### Nets
GND: Q1.2(S) Q2.2(S) Q3.2(S) R33.P$1 R34.P$1 R35.P$1 ; also sheet 1,2,3,4,5,6,7,8,9,10,11
ISH_GPIO_0: Q1.1(G) R33.P$2 ; also sheet 1
ISH_GPIO_1: Q2.1(G) R34.P$2 ; also sheet 1
ISH_GPIO_2: Q3.1(G) R35.P$2 ; also sheet 1
N$56: LED3.ANODE R39.P$2
N$57: LED2.ANODE R38.P$2
N$58: LED1.ANODE R37.P$2
N$59: LED1.CATHODE Q1.3(D)
N$60: LED2.CATHODE Q2.3(D)
N$61: LED3.CATHODE Q3.3(D)
VSYS: R37.P$1 R38.P$1 R39.P$1 ; also sheet 1,2,3

## Library data of the parts
BTN DNX PWR = mf_switches:TACT: Library: MF_Switches Description: Device for Tact Switches. Manufacture part number (MFG#) can be added via Attributes.; HOUSEPART: YES; MPN: MF-SW-TACT-4.2MM; POPULATE: 1; URL: https://factory.macrofab.com/part/MF-SW-TACT-4.2MM
C1 C28 C29 C32-C34 C36-C40 C43 = mf_passives:CAPACITOR_NP: Library: MF_Passives Description: Device for Non-Polarized Capacitors. Manufacture part number (MPN) can be added via Attributes. Check https://factory.macrofab.com/parts for the house parts list.; MPN: MF-CAP-0603-0.1uF; POPULATE: 1
C2-C4 C9 C26 C30 C35 = mf_passives:CAPACITOR_NP: Library: MF_Passives Description: Device for Non-Polarized Capacitors. Manufacture part number (MPN) can be added via Attributes. Check https://factory.macrofab.com/parts for the house parts list.; DPN: 445-9015-1-ND; MPN: C1608X5R1E106M080AC; POPULATE: 1
C5 = mf_passives:CAPACITOR_NP: Library: MF_Passives Description: Device for Non-Polarized Capacitors. Manufacture part number (MPN) can be added via Attributes. Check https://factory.macrofab.com/parts for the house parts list.; DPN: 445-9040-1-ND; MPN: C1608X5R1E475M080AC; POPULATE: 1
C6 = mf_passives:CAPACITOR_NP: Library: MF_Passives Description: Device for Non-Polarized Capacitors. Manufacture part number (MPN) can be added via Attributes. Check https://factory.macrofab.com/parts for the house parts list.; DPN: 445-12495-1-ND; MPN: CGA3E2X5R1H473M080AA; POPULATE: 1
C7 C8 C11 C12 C17 C18 C23 = mf_passives:CAPACITOR_NP: Library: MF_Passives Description: Device for Non-Polarized Capacitors. Manufacture part number (MPN) can be added via Attributes. Check https://factory.macrofab.com/parts for the house parts list.; DPN: 1276-1274-1-ND; MPN: CL10A226MP8NUNE; POPULATE: 1
C10 = mf_passives:CAPACITOR_NP: Library: MF_Passives Description: Device for Non-Polarized Capacitors. Manufacture part number (MPN) can be added via Attributes. Check https://factory.macrofab.com/parts for the house parts list.; MPN: MF-CAP-0603-1nF; POPULATE: 1
C20 C24 C25 = mf_passives:CAPACITOR_NP: Library: MF_Passives Description: Device for Non-Polarized Capacitors. Manufacture part number (MPN) can be added via Attributes. Check https://factory.macrofab.com/parts for the house parts list.; MPN: MF-CAP-0603-1uF; POPULATE: 1
C27 C31 C41 C42 = mf_passives:CAPACITOR_NP: Library: MF_Passives Description: Device for Non-Polarized Capacitors. Manufacture part number (MPN) can be added via Attributes. Check https://factory.macrofab.com/parts for the house parts list.; DPN: 445-8239-1-ND; MPN: C2012X5R1A476M125AC; POPULATE: 1
D1 D8 = mf_discrete_semiconductor:DIODES: Library: MF_Discrete_Semiconductor Description: Device for Single Packaged Diodes.; HOUSEPART: YES; MPN: MF-DIO-SOD123-BAT42; POPULATE: 1; URL: https://factory.macrofab.com/part/MF-DIO-SOD123-BAT42
D2 = joule_shield:DIODE-: DIODE; DPN: B520C-FDICT-ND; MF: Diodes Incorporated; MPN: B520C-13-F; POPULATE: 1
D3-D7 = joule_shield:ESD_DIODE; DPN: 490-13209-1-ND; MPN: LXES15AAA1-133; POPULATE: 1
F1 = joule_shield:FUSE: Fuse; DPN: F1400CT-ND; MF: Littlefuse; MPN: 046703.5NR; POPULATE: 1
FB1-FB5 = joule_shield:FERRITE_BEAD; DPN: 490-5203-1-ND; MF: Murata; MPN: BLM15PD121SN1D; POPULATE: 1
J1 = mf_connectors:USB: Library: MF_Connectors Description: 5 Pin USB Connectors. SLD is the shield connection. Usually tied to ground through a small ferrite bead.; HOUSEPART: YES; MPN: MF-CON-MICROUSB-RIGHT; POPULATE: 1; URL: https://factory.macrofab.com/part/MF-CON-MICROUSB-RIGHT
J4 = joule_shield:USB_A; DPN: 609-4413-ND; MF: Amphenol; MPN: 87583-2010BLF; POPULATE: 1
J5 = joule_shield:JST-ZH5; DPN: 455-1696-1-ND; MF: JST; MPN: S5B-ZR-SM4A-TF(LF)(SN); POPULATE: 1
J6 = joule_shield:INTEL_JOULE_J6; DPN: H11615CT-ND; MF: Hirose Electric Co Ltd; MPN: DF40C-100DS-0.4V(51); POPULATE: 1
J7 = joule_shield:INTEL_JOULE_J7; DPN: H11615CT-ND; MF: Hirose Electric Co Ltd; MPN: DF40C-100DS-0.4V(51); POPULATE: 1
J8 = joule_shield:DM3AT; DPN: HR1964CT-ND; MF: Hirose; MPN: DM3AT-SF-PEJM5; POPULATE: 1
JD1 = joule_shield:JST-XH4; DPN: 455-2262-1-ND; MF: JST Sales America Inc.; MPN: S4B-XH-SM4-TB(LF)(SN); POPULATE: 1
JFAN = joule_shield:AMP_MINI_FAN; DPN: A101008CT-ND; MF: TE Connectivity; MPN: 292228-3; POPULATE: 1
JRTC = joule_shield:BC-2009; DPN: BC-2009-ND; MF: MPD (Memory Protection Devices); MPN: BC-2009; POPULATE: 1
L1 = joule_shield:INDUCTOR; DPN: 445-15777-1-ND; MPN: SPM4012T-1R0M; POPULATE: 1
L2 = joule_shield:INDUCTOR; DPN: 490-10641-1-ND; MPN: DFE252010P-R47M=P2; POPULATE: 1
LED1 LED2 SYS = mf_leds:LED_SINGLE: Library: MF_LEDs Description: Device for Single LED Packages. Manufacture part number (MFG#) can be added via Attributes.; HOUSEPART: YES; MPN: MF-LED-0603-RED; POPULATE: 1; URL: https://factory.macrofab.com/part/MF-LED-0603-RED
LED3 = mf_leds:LED_SINGLE: Library: MF_LEDs Description: Device for Single LED Packages. Manufacture part number (MFG#) can be added via Attributes.; HOUSEPART: YES; MPN: MF-LED-0603-GREEN; POPULATE: 1; URL: https://factory.macrofab.com/part/MF-LED-0603-GREEN
Q1 Q2 Q4 Q5 = joule_shield:NFET; DPN: RE1C002UNTCLCT-ND; MF: Rohm Semiconductor; MPN: RE1C002UNTCL; POPULATE: 1
Q3 = joule_shield:NFET; DPN: RE1C002UNTCL; MF: Rohm Semiconductor; MPN: RE1C002UNTCL; POPULATE: 1
R1 R31 = mf_passives:RESISTOR: Library: MF_Passives Description: Device for Resistors. Manufacture part number (MPN), Voltage, Tolerance, and Wattage Rating can be added via Attributes. Check https://factory.macrofab.com/parts for the house parts list.; MPN: MF-RES-0603-100; POPULATE: 1
R2 R8 R13 R30 = mf_passives:RESISTOR: Library: MF_Passives Description: Device for Resistors. Manufacture part number (MPN), Voltage, Tolerance, and Wattage Rating can be added via Attributes. Check https://factory.macrofab.com/parts for the house parts list.; MPN: MF-RES-0603-0; POPULATE: 1
R3 R5-R7 R9 R12 R19 R20 R22 R23 R26 R32 R36 R40-R45 = mf_passives:RESISTOR: Library: MF_Passives Description: Device for Resistors. Manufacture part number (MPN), Voltage, Tolerance, and Wattage Rating can be added via Attributes. Check https://factory.macrofab.com/parts for the house parts list.; MPN: MF-RES-0603-100K; POPULATE: 1
R4 = mf_passives:RESISTOR: Library: MF_Passives Description: Device for Resistors. Manufacture part number (MPN), Voltage, Tolerance, and Wattage Rating can be added via Attributes. Check https://factory.macrofab.com/parts for the house parts list.; MPN: MF-RES-0603-560; POPULATE: 1
R10 = mf_passives:RESISTOR: Library: MF_Passives Description: Device for Resistors. Manufacture part number (MPN), Voltage, Tolerance, and Wattage Rating can be added via Attributes. Check https://factory.macrofab.com/parts for the house parts list.; MPN: MF-RES-0603-220K; POPULATE: 1
R11 R25 R33-R35 = mf_passives:RESISTOR: Library: MF_Passives Description: Device for Resistors. Manufacture part number (MPN), Voltage, Tolerance, and Wattage Rating can be added via Attributes. Check https://factory.macrofab.com/parts for the house parts list.; MPN: MF-RES-0603-1K; POPULATE: 1
R21 R24 = mf_passives:RESISTOR: Library: MF_Passives Description: Device for Resistors. Manufacture part number (MPN), Voltage, Tolerance, and Wattage Rating can be added via Attributes. Check https://factory.macrofab.com/parts for the house parts list.; MPN: MF-RES-0603-15K; POPULATE: 1
R27 = mf_passives:RESISTOR: Library: MF_Passives Description: Device for Resistors. Manufacture part number (MPN), Voltage, Tolerance, and Wattage Rating can be added via Attributes. Check https://factory.macrofab.com/parts for the house parts list.; MPN: MF-RES-0603-10K; POPULATE: 1
R28 R29 = mf_passives:RESISTOR: Library: MF_Passives Description: Device for Resistors. Manufacture part number (MPN), Voltage, Tolerance, and Wattage Rating can be added via Attributes. Check https://factory.macrofab.com/parts for the house parts list.; MPN: MF-RES-0603-27; POPULATE: 1
R37-R39 = mf_passives:RESISTOR: Library: MF_Passives Description: Device for Resistors. Manufacture part number (MPN), Voltage, Tolerance, and Wattage Rating can be added via Attributes. Check https://factory.macrofab.com/parts for the house parts list.; MPN: MF-RES-0603-470; POPULATE: 1
TP1 = testpad:TPSQ: Test pad; POPULATE: 0
U1 = joule_shield:BQ25892; DPN: 296-41131-1-ND; MF: Texas Instruments; MPN: BQ25892RTWT; POPULATE: 1
U2 = joule_shield:FAN8623; DPN: FAN48623UC50XCT-ND; MPN: FAN48623UC50X; POPULATE: 1
U5 U6 = joule_shield:TPS2553; DPN: 296-23999-1-ND; MF: Texas Instruments; MPN: TPS2553DRVT; POPULATE: 1
U7 U8 = joule_shield:SINGLE-BIT_BUS_TRANSCEIVER: Texas Instruments single-bit, dual supply bus transceiver; DPN: 296-16843-1-ND; MF: Texas Instruments; MPN: SN74LVC1T45DBVR; POPULATE: 1
U9 = joule_shield:SN74AVCA406L; DPN: 296-21023-1-ND; MF: Texas Instruments; MPN: SN74AVCA406LZXYR; POPULATE: 1
U10 = joule_shield:FT231X; DPN: 768-1128-1-ND; MF: FTDI; MPN: FT231XQ-R; POPULATE: 1
U$48-U$51 = joule_shield:SMTSO; POPULATE: 0
U$52-U$55 = joule_shield:M2.5MOUNT; POPULATE: 0

## Net classes
1 USB: width 0.152 mm, drill 0.305 mm, clearance 0.076 mm

## Board
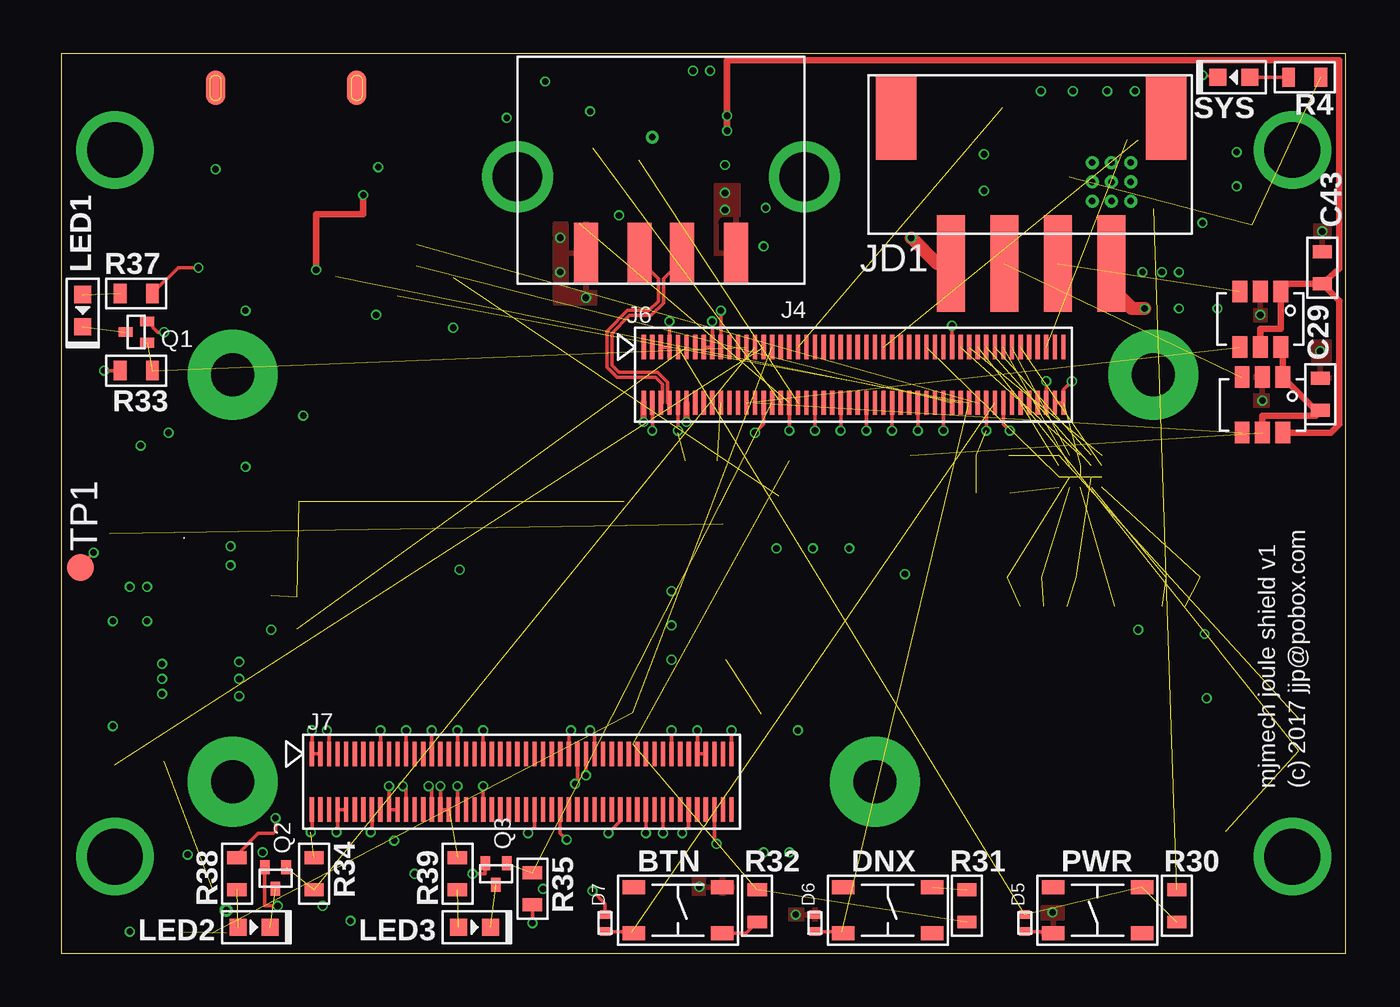
[diagram p12: board, top side]
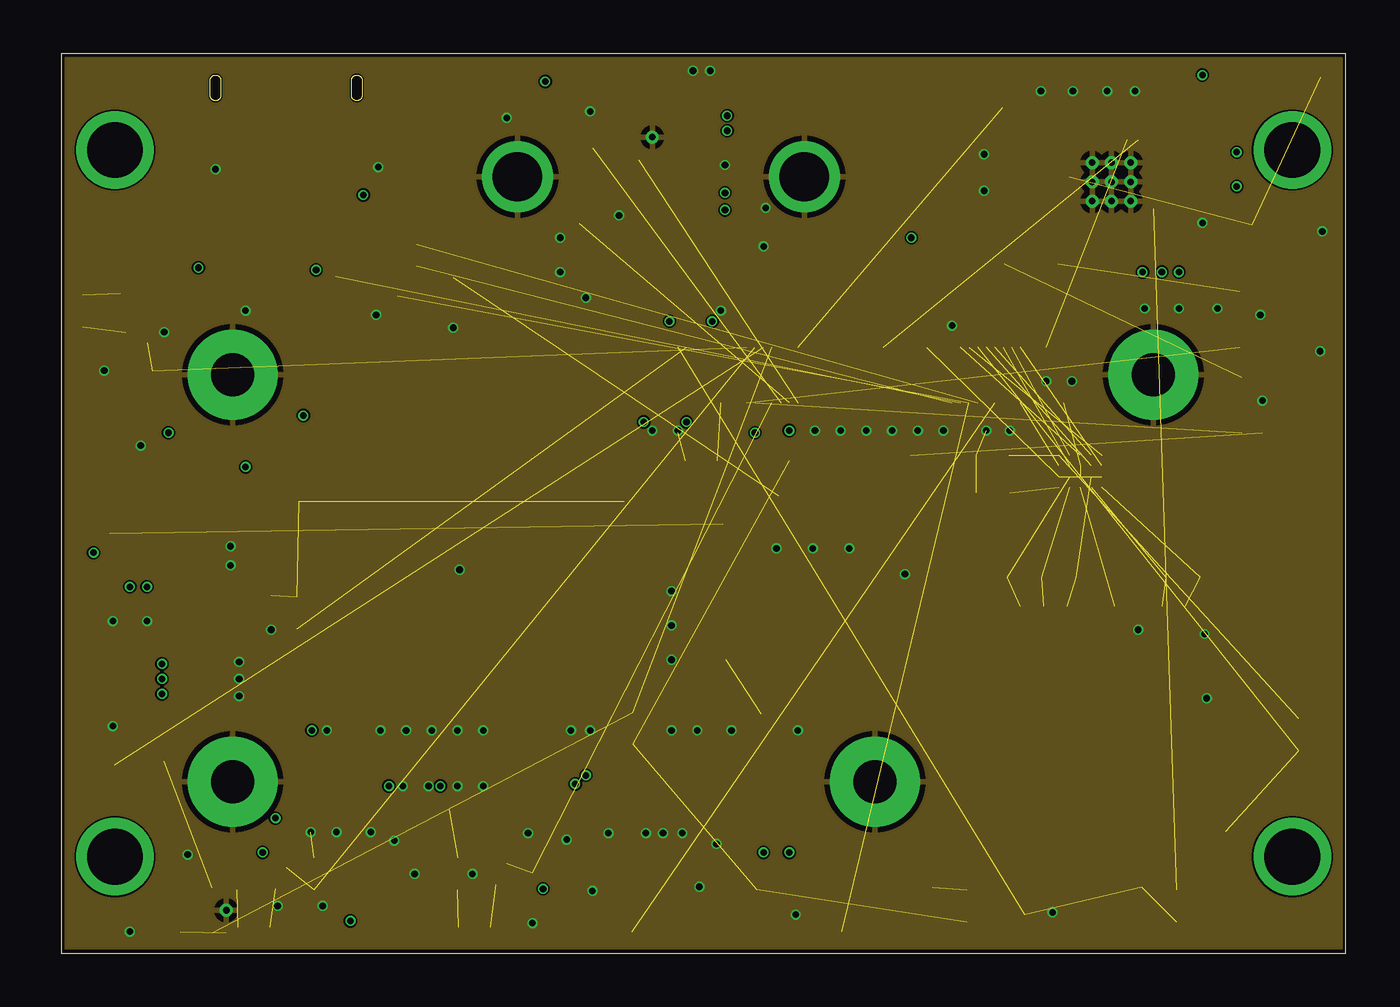
[diagram p13: board, inner layer Route2]
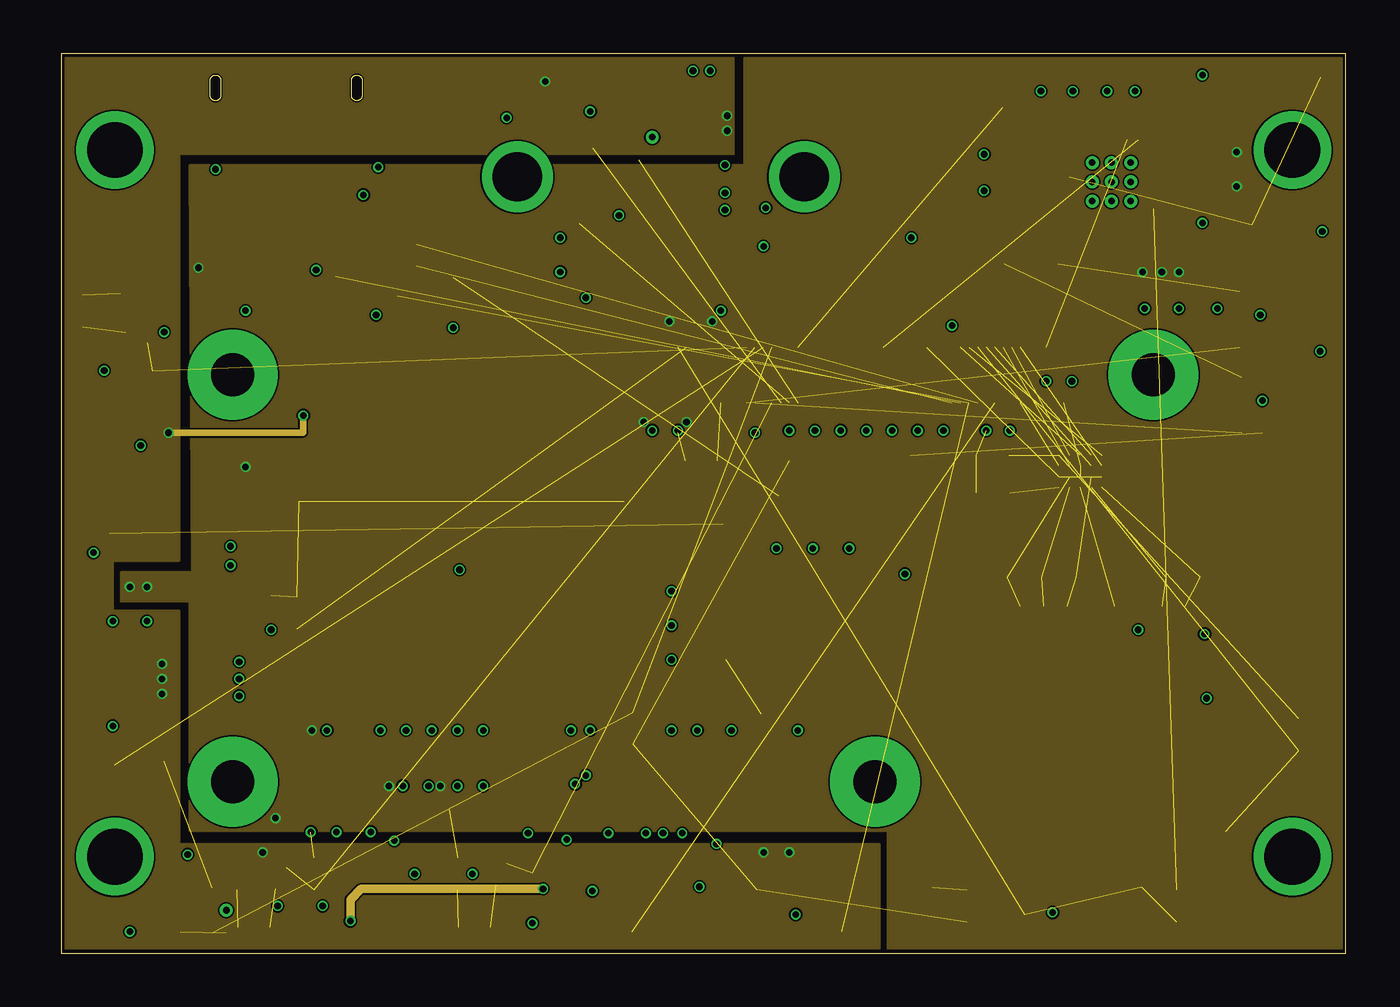
[diagram p14: board, inner layer Route15]
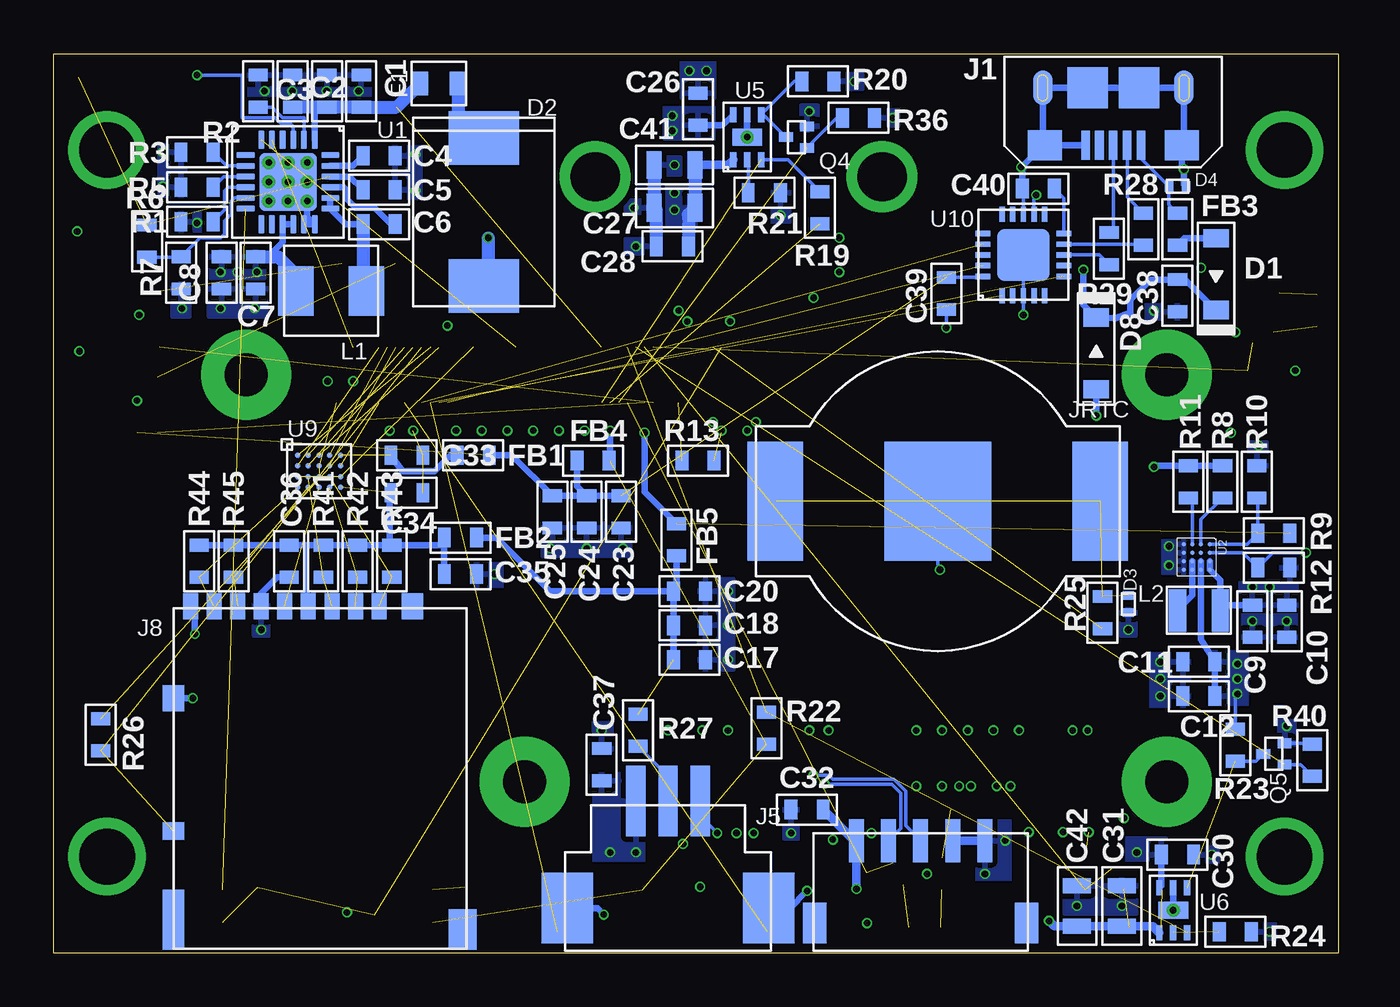
[diagram p15: board, bottom side, seen from below]

Size 60 x 42 mm. Coordinates in mm from the lower left corner, seen from the top.
Outline: 0,0 60,0 60,42 0,42 0,0
Copper layers (1*2*15*16): Top 0.035mm / dielectric 0.23mm / Route2 0.035mm / dielectric 0.93mm / Route15 0.035mm / dielectric 0.23mm / Bottom 0.035mm
Design rules "MF_Extended_4_Layer": minimum track width 3mil, minimum drill 12mil, track to track 3mil, track to pad 3mil, pad to pad 3mil, via to via 3mil, smd to smd 0mil, copper to edge 3mil, drill to drill 3mil, minimum pad ring 3mil, minimum via ring 3mil, stop-mask expansion 2mil, vias tented up to drill 25mil, thermal gap 10mil

### Footprints (pad centres in the part's own frame; a part is rotated, then mirrored left to right if it is on the bottom)
TACT4.2MM = smd 1.05 x 0.65: P$1 -2.075,1.075; P$2 2.075,1.075; P$3 -2.075,-1.075; P$4 2.075,-1.075
C0603 = smd 0.6 x 0.9: P$1 -0.75,0; P$2 0.75,0
C0805 = smd 0.7 x 1.3: P$1 -0.95,0; P$2 0.95,0
SOD-123 = smd 0.85 x 1.2: ANODE 1.675,0; CATHODE -1.675,0
B520C = smd 2.5 x 3.3: 1 -3.45,0; 2 3.45,0
M1005 = smd 0.4 x 0.5: P$1 -0.4,0; P$2 0.4,0
FUSE_467 = smd 0.762 x 1.092: 1 -0.889,0; 2 0.889,0
R0603 = smd 0.6 x 0.9: P$1 -0.75,0; P$2 0.75,0
MICROUSB-RIGHT = smd 0.4 x 1.35: 1 -1.3,1.27; 2 -0.65,1.27; 3 0,1.27; 4 0.65,1.27; 5 1.3,1.27 | smd 0.9 x 1.6: S1 -3.3,-1.4; S2 3.3,-1.4 | smd 1.6 x 1.4: S3 -3.2,1.27; S4 3.2,1.27 | smd 1.9 x 1.9: S5 -1.2,-1.405; S6 1.2,-1.405 | smd 0.9 x 1.6 bottom: S7 -3.3,-1.4; S8 3.3,-1.4
USB_RECPT_87583 = smd 1.12 x 2.88: 1 -3.5,3.58; 2 -1,3.58; 3 1,3.58; 4 3.5,3.58 | drill 2.3: S1 -6.7,0; S2 6.7,0
JST_ZH_SMT_RA_5 = smd 0.7 x 2: 1 -3,3.25; 2 -1.5,3.25; 3 0,3.25; 4 1.5,3.25; 5 3,3.25 | smd 1.1 x 1.9: S0 -4.95,-0.6; S1 4.95,-0.6
HIROSE-40C-100DS = smd 0.2 x 1.14: 1 -9.8,1.3; 2 -9.8,-1.3; 3 -9.4,1.3; 4 -9.4,-1.3; 5 -9,1.3; 6 -9,-1.3; 7 -8.6,1.3; 8 -8.6,-1.3; 9 -8.2,1.3; 10 -8.2,-1.3; 11 -7.8,1.3; 12 -7.8,-1.3; 13 -7.4,1.3; 14 -7.4,-1.3; 15 -7,1.3; 16 -7,-1.3; 17 -6.6,1.3; 18 -6.6,-1.3; 19 -6.2,1.3; 20 -6.2,-1.3; 21 -5.8,1.3; 22 -5.8,-1.3; 23 -5.4,1.3; 24 -5.4,-1.3; 25 -5,1.3; 26 -5,-1.3; 27 -4.6,1.3; 28 -4.6,-1.3; 29 -4.2,1.3; 30 -4.2,-1.3; 31 -3.8,1.3; 32 -3.8,-1.3; 33 -3.4,1.3; 34 -3.4,-1.3; 35 -3,1.3; 36 -3,-1.3; 37 -2.6,1.3; 38 -2.6,-1.3; 39 -2.2,1.3; 40 -2.2,-1.3; 41 -1.8,1.3; 42 -1.8,-1.3; 43 -1.4,1.3; 44 -1.4,-1.3; 45 -1,1.3; 46 -1,-1.3; 47 -0.6,1.3; 48 -0.6,-1.3; 49 -0.2,1.3; 50 -0.2,-1.3; 51 0.2,1.3; 52 0.2,-1.3; 53 0.6,1.3; 54 0.6,-1.3; 55 1,1.3; 56 1,-1.3; 57 1.4,1.3; 58 1.4,-1.3; 59 1.8,1.3; 60 1.8,-1.3; 61 2.2,1.3; 62 2.2,-1.3; 63 2.6,1.3; 64 2.6,-1.3; 65 3,1.3; 66 3,-1.3; 67 3.4,1.3; 68 3.4,-1.3; 69 3.8,1.3; 70 3.8,-1.3; 71 4.2,1.3; 72 4.2,-1.3; 73 4.6,1.3; 74 4.6,-1.3; 75 5,1.3; 76 5,-1.3; 77 5.4,1.3; 78 5.4,-1.3; 79 5.8,1.3; 80 5.8,-1.3; 81 6.2,1.3; 82 6.2,-1.3; 83 6.6,1.3; 84 6.6,-1.3; 85 7,1.3; 86 7,-1.3; 87 7.4,1.3; 88 7.4,-1.3; 89 7.8,1.3; 90 7.8,-1.3; 91 8.2,1.3; 92 8.2,-1.3; 93 8.6,1.3; 94 8.6,-1.3; 95 9,1.3; 96 9,-1.3; 97 9.4,1.3; 98 9.4,-1.3; 99 9.8,1.3; 100 9.8,-1.3
DM3AT = smd 0.7 x 1.2: 1 3.3,0; 2 2.2,0; 3 1.1,0; 4 0,0; 5 -1.1,0; 6 -2.2,0; 7 -3.3,0; 8 -4.4,0; 9 -5.5,0 | smd 1 x 0.8: 11 -6.3,-10.5 | smd 1 x 1.2: G0 -6.3,-4.3; G3 4.85,0 | smd 1 x 2.8: G1 -6.3,-14.65 | smd 1.3 x 1.9: G2 7.2,-15.1
JST_XH_SMT_RA_4 = smd 1.3 x 4.5: 1 -3.75,4.6; 2 -1.25,4.6; 3 1.25,4.6; 4 3.75,4.6 | smd 1.9 x 3.9: SHLD1 -6.3,-2.2; SHLD2 6.3,-2.2
AMP_MINI_292228 = smd 0.9 x 3.3: 1 -1.5,5; 2 0,5; 3 1.5,5 | smd 2.4 x 3.3: S1 -4.7,0; S2 4.7,0
BC-2009 = smd 5 x 5.56: N1 0,0 | smd 2.6 x 5.56: P1 -7.59,0; P2 7.59,0
SPM4012 = smd 1.65 x 2.3: 1 -1.65,0; 2 1.65,0
DFE252010P = smd 0.8 x 2: 1 -1,0; 2 1,0
LED0603 = smd 0.8 x 0.8: ANODE 0.75,0; CATHODE -0.75,0
EMT3F = smd 0.45 x 0.65: 1 -0.5,-0.5; 2 0.5,-0.5; 3 0,0.5
B1,27 = smd 1.27 x 1.27: TP 0,0
PWQFN-24 = smd 0.85 x 0.28: 1 -1.975,1.25; 2 -1.975,0.75; 3 -1.975,0.25; 4 -1.975,-0.25; 5 -1.975,-0.75; 6 -1.975,-1.25; 13 1.975,-1.25; 14 1.975,-0.75; 15 1.975,-0.25; 16 1.975,0.25; 17 1.975,0.75; 18 1.975,1.25 | smd 0.28 x 0.85: 7 -1.25,-1.975; 8 -0.75,-1.975; 9 -0.25,-1.975; 10 0.25,-1.975; 11 0.75,-1.975; 12 1.25,-1.975; 19 1.25,1.975; 20 0.75,1.975; 21 0.25,1.975; 22 -0.25,1.975; 23 -0.75,1.975; 24 -1.25,1.975 | smd 2.7 x 2.7: G0 0,0 | drill 0.305 pad 0.6: G1 -0.9,0.9; G2 0,0.9; G3 0.9,0.9; G4 -0.9,0; G5 0,0; G6 0.9,0; G7 -0.9,-0.9; G8 0,-0.9; G9 0.9,-0.9
WLCSP16 = smd 0.215 x 0.215: A1 -0.6,0.6; A2 -0.2,0.6; A3 0.2,0.6; A4 0.6,0.6; B1 -0.6,0.2; B2 -0.2,0.2; B3 0.2,0.2; B4 0.6,0.2; C1 -0.6,-0.2; C2 -0.2,-0.2; C3 0.2,-0.2; C4 0.6,-0.2; D1 -0.6,-0.6; D2 -0.2,-0.6; D3 0.2,-0.6; D4 0.6,-0.6
PWSON-6 = smd 0.7 x 0.3: 1 -1.05,0.65; 2 -1.05,0; 3 -1.05,-0.65; 4 1.05,-0.65; 5 1.05,0; 6 1.05,0.65 | smd 0.8 x 1.4: G0 0,0 | drill 0.305 pad 0.6: G1 0,0
SOT23-6 = smd 1 x 0.7: 1 -1.3,0.95; 2 -1.3,0; 3 -1.3,-0.95; 4 1.3,-0.95; 5 1.3,0; 6 1.3,0.95
S-PBGA-N20 = smd 0.25 x 0.25: A1 -1,0.75; A2 -0.5,0.75; A3 0,0.75; A4 0.5,0.75; A5 1,0.75; B1 -1,0.25; B2 -0.5,0.25; B3 0,0.25; B4 0.5,0.25; B5 1,0.25; C1 -1,-0.25; C2 -0.5,-0.25; C3 0,-0.25; C4 0.5,-0.25; C5 1,-0.25; D1 -1,-0.75; D2 -0.5,-0.75; D3 0,-0.75; D4 0.5,-0.75; D5 1,-0.75
QFN-20 = smd 0.7 x 0.25: 1 -1.9,1; 2 -1.9,0.5; 3 -1.9,0; 4 -1.9,-0.5; 5 -1.9,-1; 11 1.9,-1; 12 1.9,-0.5; 13 1.9,0; 14 1.9,0.5; 15 1.9,1 | smd 0.25 x 0.7: 6 -1,-1.9; 7 -0.5,-1.9; 8 0,-1.9; 9 0.5,-1.9; 10 1,-1.9; 16 1,1.9; 17 0.5,1.9; 18 0,1.9; 19 -0.5,1.9; 20 -1,1.9 | smd 2.45 x 2.45: G0 0,0
SMTSO-M1.6 = drill 2 pad 4.2: P$1 0,0
M2.5MOUNT = drill 2.6: P$1 0,0

### Placement (x,y rotation side)
BTN  28.8,2 180 top
C1  45.63,40.25 90 bottom
C2  47.23,40.25 90 bottom
C3  48.83,40.25 90 bottom
C4  44.8,37.23 0 bottom
C5  44.8,35.64 0 bottom
C6  44.8,34.04 0 bottom
C7  50.56,31.76 270 bottom
C8  52.16,31.76 270 bottom
C9  4,15.5 270 bottom
C10  2.4,15.5 270 bottom
C11  6.5,13.6 180 bottom
C12  6.5,12 180 bottom
C17  30.3,13.7 0 bottom
C18  30.3,15.3 0 bottom
C20  30.3,16.9 0 bottom
C23  33.5,20.6 270 bottom
C24  35.1,20.6 270 bottom
C25  36.7,20.6 270 bottom
C26  29.9,39.4 90 bottom
C27  31,34.8 180 bottom
C28  31.1,33 180 bottom
C29  58.8,26.1 90 top
C30  7.5,4.6 0 bottom
C31  10.1,2.2 90 bottom
C32  24.8,6.7 180 bottom
C33  43.5,23.25 0 bottom
C34  43.5,21.5 0 bottom
C35  41,17.7 0 bottom
C36  49,18.3 270 bottom
C37  34.4,8.8 90 bottom
C38  7.5,30.7 270 bottom
C39  18.3,30.8 270 bottom
C40  14,35.7 180 bottom
C41  31,36.8 180 bottom
C42  12.2,2.2 90 bottom
C43  58.9,32 90 top
D1  5.7,31.7 90 bottom
D2  39.9,34.6 270 bottom
D3  9.8,16.3 90 bottom
D4  7.5,35.8 180 bottom
D5  45,1.4 90 top
D6  35.2,1.4 270 top
D7  25.4,1.4 270 top
D8  11.3,28 270 bottom
DNX  38.6,2 180 top
F1  42,40.6 180 bottom
FB1  40.4,23.25 180 bottom
FB2  41,19.4 0 bottom
FB3  7.5,33.8 270 bottom
FB4  34.8,23 180 bottom
FB5  30.9,19.3 270 bottom
J1  10.5,39 180 bottom
J4  28,36.25 180 top
J5  19.5,2 0 bottom
J6  37,27 0 top
J7  21.5,8 0 top
J8  48.1,16.2 0 bottom
JD1  45.3,36.8 180 top
JFAN  31.3,2.1 0 bottom
JRTC  18.7,21.1 0 bottom
L1  47.04,30.92 180 bottom
L2  6.5,16 0 bottom
LED1  1,30 90 top
LED2  9,1.2 180 top
LED3  19.3,1.2 180 top
PWR  48.4,2 0 top
Q1  3.5,29 90 top
Q2  10,3.5 180 top
Q3  20.3,3.7 180 top
Q4  25.3,38.1 90 bottom
Q5  3,9.3 90 bottom
R1  53.3,34.15 180 bottom
R2  50.45,40.25 90 bottom
R3  53.3,37.4 180 bottom
R4  58.07,40.9 180 top
R5  53.3,35.76 0 bottom
R6  55.64,33.25 270 bottom
R7  54.04,31.76 270 bottom
R8  5.4,22 270 bottom
R9  3,19.6 180 bottom
R10  3.8,22 90 bottom
R11  7,22 270 bottom
R12  3,18 180 bottom
R13  29.9,23 0 bottom
R19  24.2,34.8 90 bottom
R20  24.3,40.7 180 bottom
R21  26.8,35.5 0 bottom
R22  26.7,10.5 90 bottom
R23  4.8,9.7 270 bottom
R24  4.8,1 0 bottom
R25  11,15.9 270 bottom
R26  57.8,10.2 270 bottom
R27  32.7,10.4 270 bottom
R28  9.1,33.8 270 bottom
R29  10.7,32.9 270 bottom
R30  52.1,2.2 90 top
R31  42.3,2.2 90 top
R32  32.5,2.2 270 top
R33  3.5,27.2 0 top
R34  11.8,3.7 270 top
R35  22,3 90 top
R36  22.4,39 0 bottom
R37  3.5,30.8 180 top
R38  8.2,3.7 270 top
R39  18.5,3.7 270 top
R40  1.2,9 90 bottom
R41  47.4,18.3 270 bottom
R42  45.8,18.3 270 bottom
R43  44.2,18.3 270 bottom
R44  53.2,18.3 270 bottom
R45  51.6,18.3 270 bottom
SYS  54.76,40.9 0 top
TP1  0.9,18 180 top
U1  49.05,36.01 270 bottom
U2  6.6,18.5 270 bottom
U5  27.6,38.1 90 bottom
U6  7.7,2 90 bottom
U7  56,29.6 270 top
U8  56.1,25.6 270 top
U9  47.6,22.5 0 bottom
U10  14.7,32.6 90 bottom
U$48  8,8 0 top
U$49  51,27 0 top
U$50  8,27 0 top
U$51  38,8 0 top
U$52  57.5,37.5 0 top
U$53  2.5,4.5 0 top
U$54  2.5,37.5 0 top
U$55  57.5,4.5 0 top

### Tracks (layer width: path | path; a pad name or v marks a point on that pad's centre or on a via)
BTN_N  (1 unrouted)
  Top 0.152: D7.P$2 26.65,1 BTN.P$2
GND  (via drill 0.31)  (6 unrouted)
  Top 0.152: v27.6,24.4 J6.4 | J6.10 28.8,24.3 v28.8,24.4 | v35.2,24.4 J6.42 | J6.48 v36.4,24.4 | J6.54 v37.6,24.4 | J6.60 v38.8,24.4 | J6.66 v40,24.4 | J6.72 v41.2,24.4 | J6.82 43.2,24.7 v43.2,24.4 | J6.86 44,24.7 v44.3,24.4 | J6.96 v46,26.7 | v47.2,26.7 46.8,26.3 J6.100 J6.98 | J6.19 v30.8,30 | J7.2 11.7,5.7 v11.65,5.65 | v12.85,5.65 12.9,5.7 J7.8 J7.10 | J7.16 14.5,5.7 v14.45,5.65 | J7.24 16.1,7.65 v15.95,7.8 | J7.30 17.3,7.65 v17.15,7.8 | J7.36 v18.5,7.8 | J7.42 v19.7,7.8 | J7.41 v19.7,10.4 | J7.35 v18.5,10.4 | J7.29 v17.3,10.4 | J7.23 v16.1,10.4 | J7.17 v14.9,10.4 | J7.5 12.5,10.3 v12.4,10.4 | J7.61 23.7,10.3 v23.8,10.4 | J7.67 24.9,10.2 v24.7,10.4 | J7.85 v28.5,10.4 | v29.7,10.4 J7.91 J7.93 | J7.99 v31.3,10.4 | J7.54 22.1,5.9 v21.8,5.6 | J7.60 23.3,5.6 v23.6,5.3 | J7.74 26.1,6.15 v25.55,5.6 | J7.80 v27.3,5.6 | J7.84 v28.1,5.6 | J7.90 29.3,5.9 v29,5.6 | J7.96 30.5,5.2 v30.6,5.1 | J6.73 v41.6,29.3 | PWR.P$3 46.33,1 D5.P$1 | D7.P$1 25.4,2.3 v24.8,2.9 | Q1.2 4.5,29 v4.8,29 | R33.P$1 v2,27.2 | Q2.2 9.5,2.2 v10.1,2.2 | Q3.2 19.8,3.7 v19.2,3.7 | R35.P$1 v22,1.4
  Top 0.6: JD1.1 49.05,31.05 50,30.1 v50.6,30.1
  Bottom 0.152: R40.P$2 1.25,9.8 Q5.2 | JFAN.3 29.8,6.4 v29,5.6 | JRTC.N1 18.7,18 v18.6,17.9 | v14.7,29.8 U10.3 U10.G0 | C39.P$2 v18.3,29.2 | C40.P$2 14.7,35.65 U10.13
  Bottom 0.305: U1.17 U1.18 48.15,34.38 U1.G3 | U5.G1 U5.5 | U6.G1 U6.5 | JFAN.S1 34.6,2.1 v34.3,1.8 | JFAN.S2 25.6,2.1 v24.8,2.9 | J8.9 53.4,16 v53.4,14.9 | J8.6 50.3,16.8 49.55,17.55 C36.P$2 | J8.G0 v53.5,11.9 | D4.P$1 7.2,35.9 v7.2,36.6 7.3,36.7 J1.S3 7.2,37.83 J1.S1 J1.S5 J1.S6 J1.S2 13.8,37.83 J1.S4 J1.5 | 13.8,37.7 v14.8,36.7 14.75,36.65 C40.P$2
  Bottom 0.406: J5.5 J5.4
  Bottom 0.6: C41.P$2 C27.P$2 31.85,34.7 C28.P$2
  other vias: 8.3,13.6 8.3,12.8 8.3,12 9.8,15.1 3.7,23.7 28.5,16.9 28.5,15.3 28.5,13.7 36.8,18.9 35.1,18.9 33.4,18.9 58.8,28.1 58.9,33.7 43.1,37.3 43.1,35.6 52.2,30.1 54,30.1 45.75,40.25 47.25,40.25 48.85,40.25 50.15,40.25 53.3,34.1 2.4,15.5 4,15.5 7.9,19 7.9,18.1 29.5,41.2 30.3,41.2 31,36.8 32.9,34.8 32.8,33 20.8,39 24.7,39.3 23.3,33.4 24.5,30.6 23.3,31.8 26.05,34.45 2.4,10.6 5.9,4.6 12.2,2.2 3.2,1 15.55,5.25 16.5,3.7 34.4,10.4 56.1,25.8 56,29.8 46.3,1.9 29.8,3.1 39.4,17.7 50.3,15.1 8.6,30
  pour Route2: 0.2,41.8 59.8,41.8 59.8,0.2 0.2,0.2
  pour Bottom: 44.2,37.7 42.8,37.7 42.8,35.2 44.2,35.2
  pour Bottom: 6.9,14 8.8,14 8.8,11.5 6.9,11.5
  pour Bottom: 7.15,19.3 7.15,17.7 8.2,17.7 8.2,19.3
  pour Bottom: 3.3,23.9 3.3,22.5 4.2,22.5 4.2,23.9
  pour Bottom: 33,18.5 33,20.1 37.2,20.1 37.2,18.5
  pour Top: 58.4,26.6 59.3,26.6 59.3,28.6 58.4,28.6
  pour Top: 55.7,27.2 55.7,25.5 56.4,25.5 56.4,27.2
  pour Bottom: 9.4,16.1 10.2,16.1 10.2,14.8 9.4,14.8
  pour Bottom: 28.2,17.5 29.9,17.5 29.9,13.2 28.2,13.2
  pour Top: 58.5,34 58.5,32.5 59.3,32.5 59.3,34
  pour Bottom: 50,31.2 52.8,31.2 52.8,29.7 50,29.7
  pour Bottom: 53.6,31.3 54.5,31.3 54.5,29.7 53.6,29.7
  pour Bottom: 45.2,41.3 45.2,40 50.9,40 50.9,41.3
  pour Bottom: 53.1,34.6 54.3,34.6 54.3,33.7 53.1,33.7
  pour Bottom: 1.9,15.8 4.5,15.8 4.5,14.5 1.9,14.5
  pour Bottom: 29.1,41.6 29.1,39.9 30.7,39.9 30.7,41.6 30.6,41.6
  pour Bottom: 31.6,33.4 31.6,32.6 33.3,32.6 33.3,33.4
  pour Bottom: 31.7,35.2 31.7,34.5 33.3,34.5 33.3,35.2
  pour Bottom: 30.7,37.2 30.7,36.3 32.2,36.3 32.2,37.2
  pour Bottom: 20.6,39.4 21.9,39.4 21.9,38.6 20.5,38.6 20.5,39.4
  pour Bottom: 24.3,39.6 24.3,38.4 25.1,38.4 25.1,39.6
  pour Top: 23,34.1 23,30.3 25,30.3 25,34.1
  pour Bottom: 25.6,35.9 25.6,34.1 26.45,34.1 26.45,35.9
  pour Bottom: 2,10.9 2,9.6 2.8,9.6 2.8,10.9
  pour Bottom: 5.6,5 5.6,4.2 7,4.2 7,5
  pour Bottom: 9.4,3.5 9.4,1.8 12.8,1.8 12.8,3.5
  pour Bottom: 2.9,1.4 2.9,0.6 4.3,0.6 4.3,1.4
  pour Bottom: 25.2,7.1 25.2,5.3 25.9,5.3 25.9,7.1
  pour Bottom: 15.3,6.2 15.3,3.4 16.9,3.4 16.9,6.2
  pour Bottom: 33.9,10.8 33.9,9.3 34,9.3 34.8,9.3 34.8,10.8
  pour Top: 55.7,31.2 55.7,29.5 56.3,29.5 56.3,31.2
  pour Top: 45.8,2.2 46.8,2.2 46.8,0.7 45.8,0.7
  pour Top: 34,2.1 35.5,2.1 35.5,1.5 34,1.5
  pour Top: 29.5,3.5 31.4,3.5 31.4,2.7 29.5,2.7
  pour Bottom: 39,18.2 40.5,18.2 40.5,17.1 39,17.1
  pour Bottom: 49.9,16.8 50.7,16.8 50.7,14.8 49.9,14.8
  pour Bottom: 7.1,30.3 9,30.3 9,29.6 7.1,29.6
I2C_0_SCL  (1 unrouted)
I2C_0_SDA  (1 unrouted)
ISH_GPIO_0  (2 unrouted)
ISH_GPIO_1  (2 unrouted)
ISH_GPIO_2  (2 unrouted)
ISH_GPIO_3  (1 unrouted)
  Bottom 0.152: R36.P$1 23.4,39 Q4.1
ISH_GPIO_4  (1 unrouted)
  Bottom 0.152: R40.P$1 1.75,8.8 Q5.1
ISH_GPIO_5  (1 unrouted)
  Bottom 0.152: R19.P$2 25.7,37.05 U5.3
ISH_GPIO_6  (2 unrouted)
JOULE_RX_18V  (1 unrouted)
JOULE_TX_18V  (1 unrouted)
N$1
  Top 0.152: SYS.ANODE R4.P$2
N$2
  Bottom 0.305: C4.P$1 46.02,36.76 U1.23
N$3
  Bottom 0.152: R1.P$1 52,34.7 52,35.6 51.84,35.76 U1.10
N$4
  Bottom 0.152: U1.2 48.3,39 49.3,39 49.8,39.5 R2.P$1
N$5
  Bottom 0.152: R3.P$1 51.91,36.76 U1.8
N$6  (via drill 0.31)
  Top 0.152: v53.3,41 SYS.CATHODE
  Bottom 0.152: U1.3 48.8,38.6 48.95,38.75 49.4,38.75 49.65,39 51.2,39 51.2,41 v53.3,41
N$7
  Bottom 0.152: U2.B1 6.4,20.25 R8.P$2
N$8
  Bottom 0.152: U1.11 51.54,35.26 51.7,35.1 51.7,34.5 52,34.2 52,33.6 52.2,33.4 53.15,33.4 R7.P$1 R6.P$2
N$9
  Bottom 0.152: R5.P$2 52.05,36.26 U1.9
N$10  (1 unrouted)
N$11
  Bottom 0.305: C6.P$2 44.24,34.04 45,34.8 45.9,34.8 46.3,35.2 46.3,35.6 46.45,35.75 U1.21
N$12
  Bottom 0.305: C6.P$1 46.35,34.04 U1.19 U1.20
  Bottom 0.6: C6.P$1 45.55,31.08 L1.1
N$13
  Bottom 0.305: L2.1 6.8,16.7 U2.C4 U2.C3
N$14
  Bottom 0.152: U2.A1 4.25,19.1 R9.P$2 3.75,21.2 R10.P$1
N$15
  Bottom 0.152: U2.C1 6.8,21.05 R11.P$2
N$16
  Bottom 0.305: FB3.P$2 7.17,33.38 D1.ANODE
N$18  (via drill 0.31)
  Top 0.152: v1.5,18.7 0.9,18.1 TP1.TP
  Bottom 0.152: U2.A2 4.45,18.7 R12.P$2 3.05,18.7 v1.5,18.7
N$24
  Bottom 0.152: R20.P$2 25.4,40.7 U5.4 26.85,39.15 Q4.3
N$29
  Bottom 0.152: R21.P$1 27.55,37 U5.2
N$30  (3 unrouted)
N$31
  Bottom 0.6: F1.1 41.11,39.26 D2.1
N$33  (1 unrouted)
  Bottom 0.152: Q5.3 3.85,8.95 R23.P$2
N$34  (1 unrouted)
N$36
  Bottom 0.152: R27.P$2 31.3,8.25 JFAN.2
N$39
  Bottom 0.152: U10.9 9.15,33.1 R28.P$2
N$41  (2 unrouted)
N$42  (2 unrouted)
N$43  (2 unrouted)
N$44  (2 unrouted)
N$45  (1 unrouted)
N$46
  Bottom 0.152: FB3.P$1 7.9,34.95 D4.P$2 9.2,37.1 J1.1
N$47
  Bottom 0.152: R29.P$2 11.15,32.6 U10.8
N$48
  Bottom 0.152: R29.P$1 10.5,33.85 J1.3
N$49  (via drill 0.31)
  Top 0.305: v11.9,31.9 11.9,34.5 14.1,34.5 v14.1,35.4
  Bottom 0.152: v14.1,35.4 14.2,35.4 U10.12
  Bottom 0.305: D1.CATHODE 7.12,31.45 C38.P$1 8.75,31.45 9.7,30.5 9.7,29.9 10.4,29.65 D8.CATHODE 11.9,30.27 v11.9,31.9
N$50
  Bottom 0.152: R28.P$1 9.85,35.3 J1.2
N$51  (1 unrouted)
N$52  (1 unrouted)
N$53
  Bottom 0.152: U10.10 12.8,35.25 C40.P$1
N$54
  Top 0.152: BTN.P$1 31.98,0.93 R32.P$2
N$56  (1 unrouted)
N$57  (1 unrouted)
N$58  (1 unrouted)
N$59  (1 unrouted)
N$60  (1 unrouted)
N$61  (1 unrouted)
N$69  (2 unrouted)
PMIC_PWRBTN_N  (3 unrouted)
SDCARD_CD  (2 unrouted)
SDCARD_CLK  (1 unrouted)
SDCARD_CLK_FB  (1 unrouted)
SDCARD_CMD  (1 unrouted)
SDCARD_D0  (1 unrouted)
SDCARD_D1  (1 unrouted)
SDCARD_D2  (1 unrouted)
SDCARD_D3  (1 unrouted)
SDCARD_LVL_CMD_DIR  (1 unrouted)
SDCARD_LVL_DAT_DIR  (2 unrouted)
SDCARD_VCCA  (2 unrouted)
  Bottom 0.305: FB1.P$2 41.45,23.25 42.2,22.5 43.7,22.5 C33.P$1
SDCARD_VCCB  (1 unrouted)
  Bottom 0.305: C35.P$1 FB2.P$1 41.75,19.05 R43.P$1 44.3,19.05 | 44.3,19.05 R42.P$1 R41.P$1 48.2,19.05 | 48.2,19.05 C36.P$1 R45.P$1 R44.P$1 | J8.4 48.2,16.3 48.2,19.05 | C34.P$1 44.3,21.5 44.3,19.05
SERVO_RX_5V  (1 unrouted)
SERVO_TX_5V  (1 unrouted)
UART2_CTS  (1 unrouted)
UART2_RTS  (1 unrouted)
UART2_RX  (1 unrouted)
UART2_TX  (2 unrouted)
  Top 0.152: D6.P$2 36.45,1 DNX.P$2
USB2_0_N
  Top 0.152: J6.8 28.31,25.7 28.31,26.65 27.85,27.11 26.05,27.11 25.71,27.45 25.71,28.95 26.55,29.79 27.55,29.79 28.11,30.35 28.11,31.5 29,32.39 J4.2
USB2_0_P
  Top 0.152: J6.6 28.09,25.7 28.09,26.55 27.75,26.89 25.95,26.89 25.49,27.35 25.49,29.05 26.45,30.01 27.45,30.01 27.89,30.45 27.89,31.5 27,32.39 J4.3
USB2_1_N  (via drill 0.31)
  Top 0.152: v24,7.9 24.1,8 J7.63
  Bottom 0.152: J5.2 20.41,5.84 20.41,7.45 20.85,7.89 23.99,7.89 v24,7.9
USB2_1_P  (via drill 0.31)
  Top 0.152: v24.5,8.3 J7.65
  Bottom 0.152: J5.3 20.19,5.94 20.19,7.55 20.75,8.11 23.6,8.11 23.79,8.3 v24.5,8.3
V1P8V  (2 unrouted)
  Top 0.305: C29.P$1 58.6,25.35 | 58.6,25.35 U8.1 57.05,28.2 U7.6 | 58.6,25.35 58.6,25.1 56.1,25.1 U8.5
  Bottom 0.152: U10.20 16.65,31.55 C39.P$1
  Bottom 0.305: 36.75,21.3 C25.P$1 | C25.P$1 C24.P$1 | C24.P$1 C23.P$1 | FB4.P$2 35.55,21.8 C24.P$1 | C25.P$1 38.6,23.25 FB1.P$1
V3P3V  (1 unrouted)
  Bottom 0.305: FB5.P$2 30.9,17.05 C20.P$1 | C20.P$1 C18.P$1 C17.P$1 | FB2.P$2 39.3,19.4 36.8,16.9 C20.P$1
V5P0V  (via drill 0.31)
  Top 0.305: v31.1,38.4 31.1,41.7 59.7,41.7 59.7,31.95 C43.P$1 | C43.P$1 59.7,30.45 59.7,24.7 59.3,24.3 U8.6 | C43.P$1 57.3,31.25 U7.1 56.95,29.15 56,29.15 U7.5
  Route15 0.305: v5,24.3 11.3,24.3 v11.3,25.1
  Bottom 0.152: v4.7,12.1 4.8,12 R23.P$1
  Bottom 0.305: U2.B3 U2.B4 6.4,14.65 C11.P$1 C12.P$1 | U5.6 28.75,38.65 C26.P$1 | U6.6 8.25,3.15 C30.P$1 | v11.3,25.1 D8.ANODE
  other vias: 4.7,13.5 4.7,12.8 31.1,39.1 22.6,40.7 9.4,4.7 32.8,4.7 34,4.7
  pour Route15: 0.2,41.8 31.4,41.8 31.4,37.3 5.5,37.3 5.5,18.3 2.4,18.3 2.4,16 5.5,16 5.5,5.1 38.2,5.1 38.2,0.2 0.2,0.2
  pour Bottom: 4.2,14.1 6,14.1 6,11.6 4.2,11.6
  pour Bottom: 29.1,39.5 31.5,39.5 31.5,38 29.1,38
  pour Bottom: 22.2,41.1 22.2,40.3 23.8,40.3 23.8,41.1
  pour Bottom: 8,5.4 8,4.3 9.9,4.3 9.9,5.4
  pour Bottom: 32.4,8.4 34.8,8.4 34.8,4.3 32.4,4.3
V5P0V_USBA  (via drill 0.31)
  Bottom 0.406: U5.1 28.5,36.8 C41.P$1
  Bottom 0.6: C41.P$1 C27.P$1 30.35,34.5 C28.P$1
  other vias: 31,35.5 31,34.7
  pour Bottom: 29.8,35.9 31.4,35.9 31.4,34 29.8,34
  pour Top: 30.5,35.9 30.5,32.6 31.7,32.6 31.7,35.9
V5P0V_USBB  (via drill 0.31)
  Route15 0.406: v13.5,1.5 13.5,2.5 14,3 v22.5,3
  Bottom 0.406: U6.1 8.65,1.25 C31.P$1 C42.P$1 13.25,1.25 v13.5,1.5 | v22.5,3 J5.1 22.6,5.25 C32.P$1
VDC_JACK  (via drill 0.31)
  Top 0.6: JD1.4 40.9,32.2 v39.7,33.4
  Bottom 0.6: v39.7,33.4 39.7,31.35 D2.2
VDD1  (via drill 0.31)  (4 unrouted)
  Top 0.152: J6.36 v34,24.4
  Bottom 0.152: v34,24.4 33.9,24.4
  Bottom 0.305: FB4.P$1 34,23 v34,24.4
VDD3  (via drill 0.31)  (1 unrouted)
  Top 0.152: J6.30 32.8,24.7 v32.4,24.3
  Bottom 0.305: FB5.P$1 32.4,21.55 v32.4,24.3
VIN_CHRG  (1 unrouted)
  Bottom 0.305: U1.1 47.8,39.5 C2.P$1
  Bottom 0.6: C3.P$1 C2.P$1 C1.P$1 43.99,39.5 F1.2
VREGN  (2 unrouted)
  Bottom 0.305: C5.P$1 46.17,36.26 U1.22
VRTC  (1 unrouted)
VSYS  (via drill 0.31)  (1 unrouted)
  Top 0.152: v28.4,29.5 J6.7 J6.5 | v30.4,29.5 J6.17 J6.15 | v11.7,10.4 J7.1 J7.3 | v15.3,7.8 J7.20 J7.22 | v17.7,7.8 J7.32 J7.34 | R37.P$1 5.45,32 v6.4,32 | R38.P$1 8.2,4.6 9.2,5.6 9.9,5.6 10,5.7 v10,6.3
  Top 0.305: v27.2,24.8 J6.2 | v29.2,24.8 J6.12
  Bottom 0.305: U2.A3 U2.A4 5.5,17.4 L2.2 5.25,16.25 C9.P$1 | C7.P$1 49.99,32.51 49.3,33.2 U1.15 U1.16 | R8.P$1 R11.P$1 8.6,22.75 v8.6,22.7
  Bottom 0.6: C7.P$1 49.51,32.51 48.7,31.7 L1.2
  other vias: 4,17.1 3.2,17.1 52.2,31.8 51.4,31.8 50.5,31.8 54.9,37.4 54.9,35.8
  pour Route15: 6,36.8 31.9,36.8 31.9,41.8 59.8,41.8 59.8,0.2 38.6,0.2 38.6,5.7 6,5.7 6,16.4 2.8,16.4 2.8,17.8 6.1,17.8
  pour Bottom: 1.9,16 4.6,16 4.6,17.35 2.7,17.35 2.7,18.4 1.9,18.4
  pour Bottom: 50.1,32.8 52.7,32.8 52.7,32.7 52.7,31.5 50.1,31.5
  pour Bottom: 53.8,37.8 53.8,35.3 55.1,35.3 55.1,37.8

### Text on the board
tPlace: mjmech joule shield v1 | (c) 2017 jjp@pobox.com